# Altium project STEP_DRIVER_V3.0.PrjPcb (part 1 of 2)
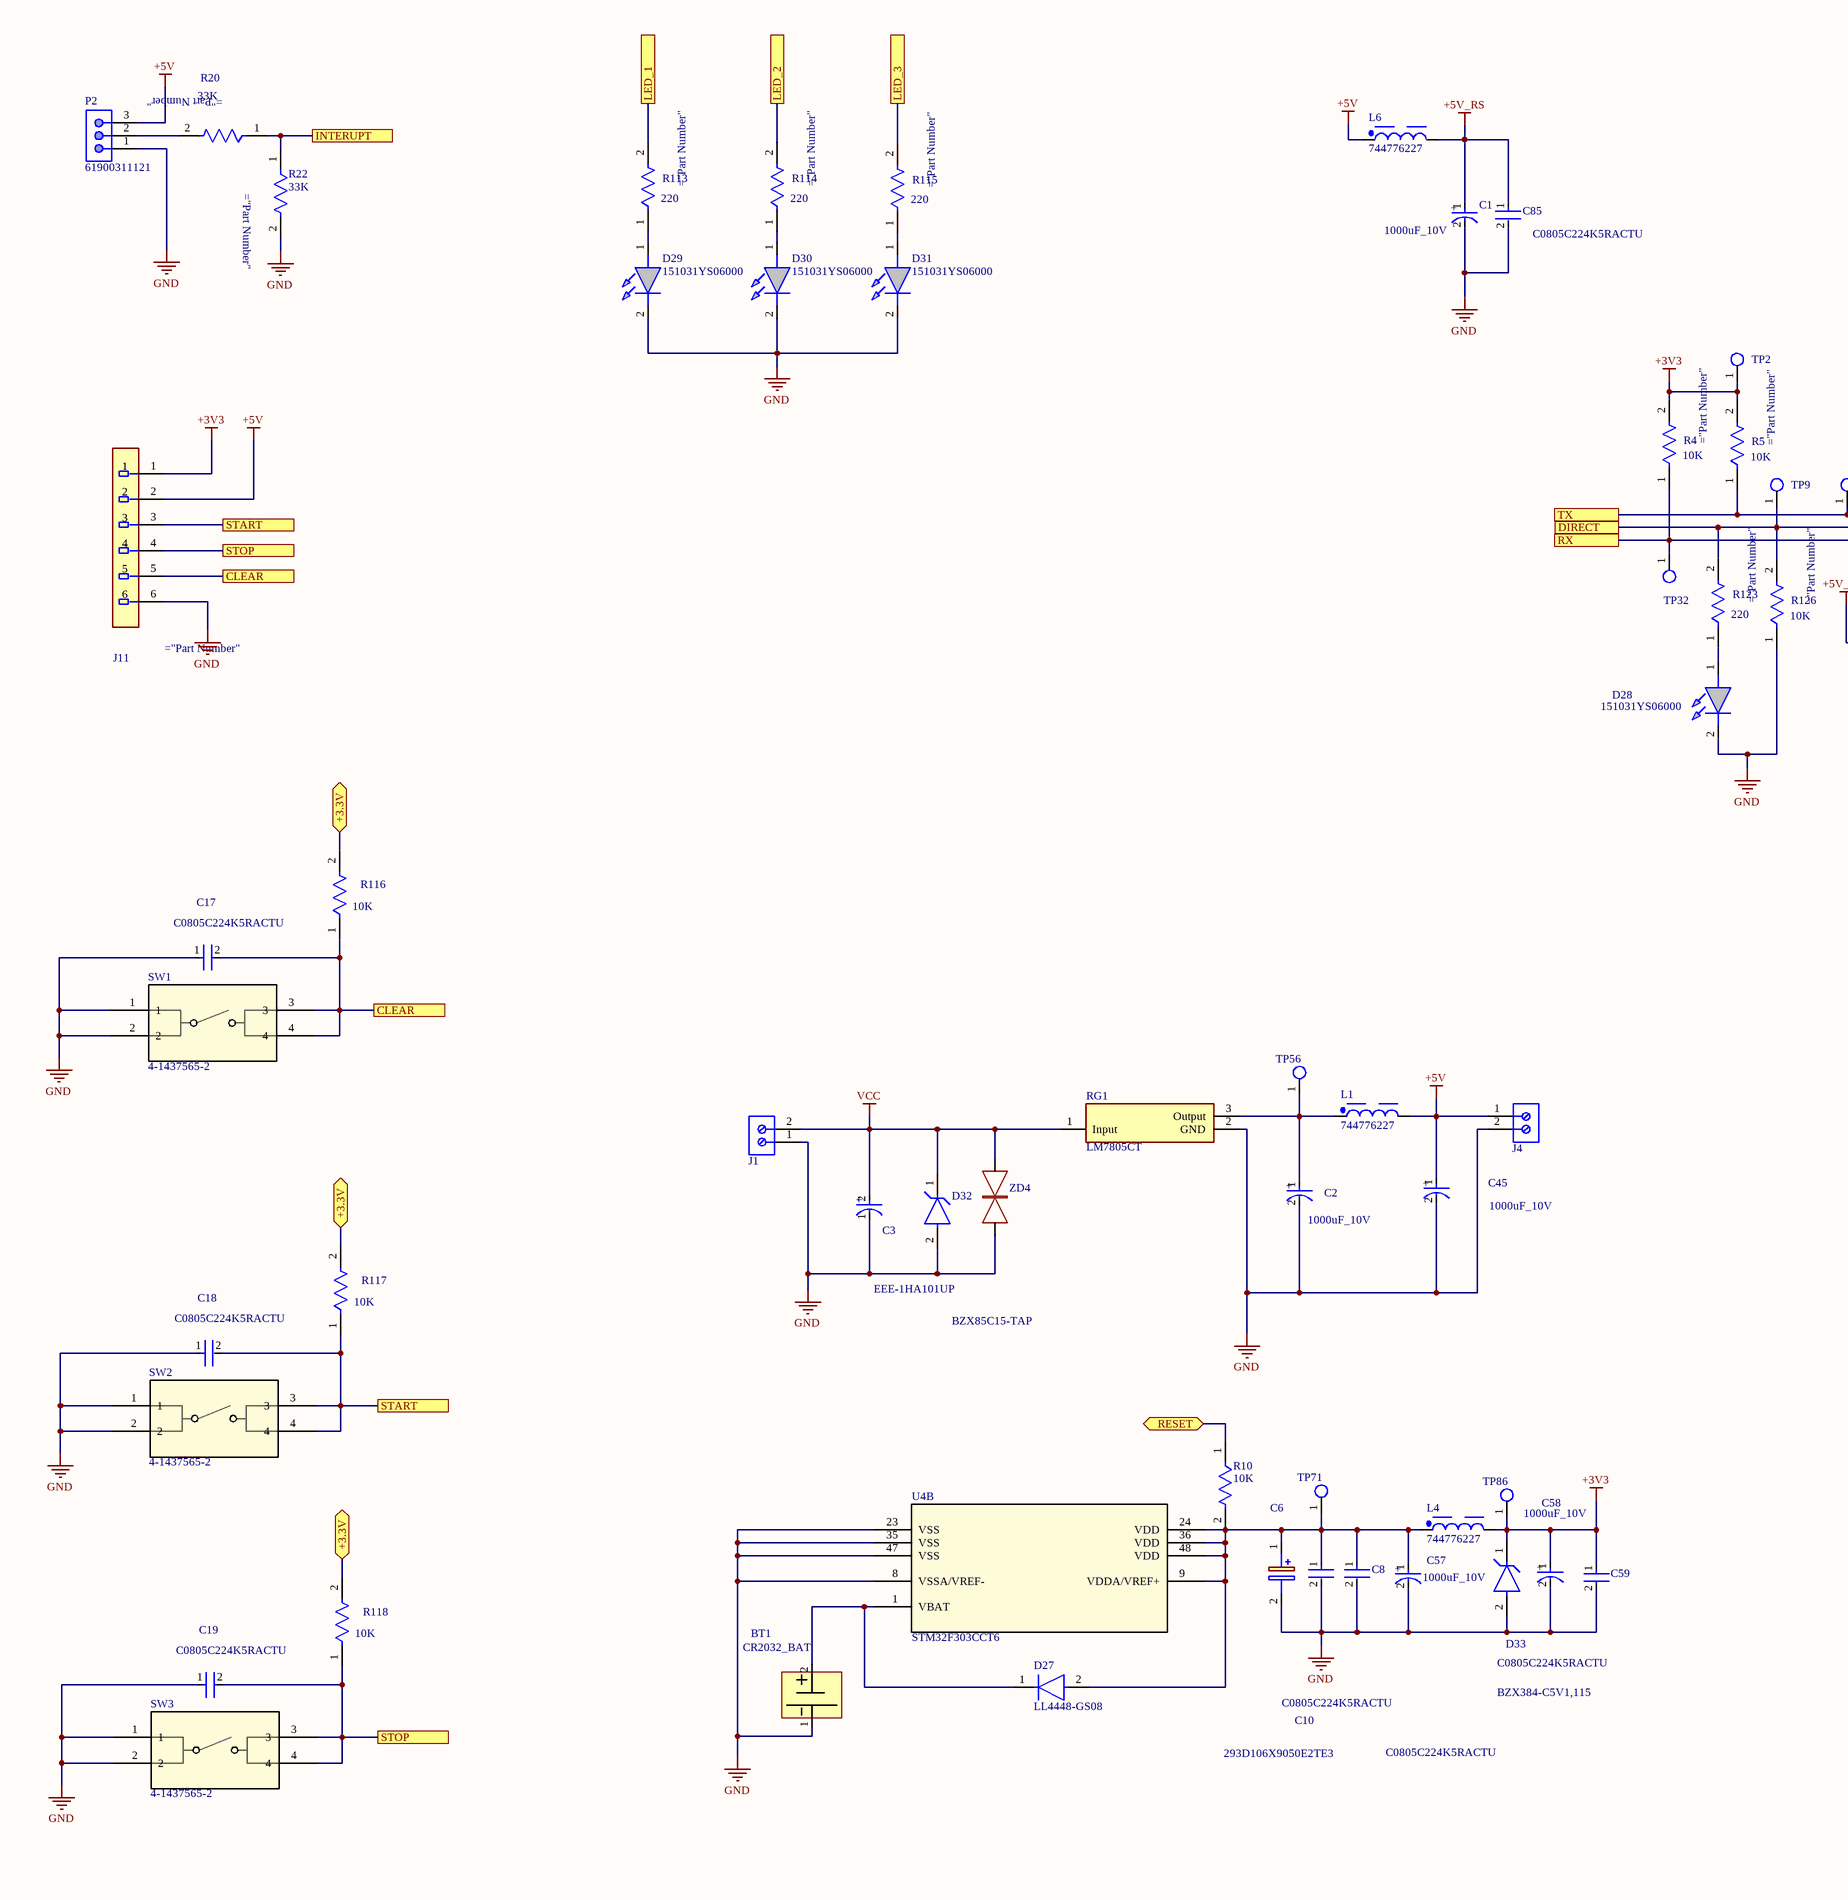
[diagram p0: STEP_DRIVER_V3.0.SchDoc, top column 1 of 4]
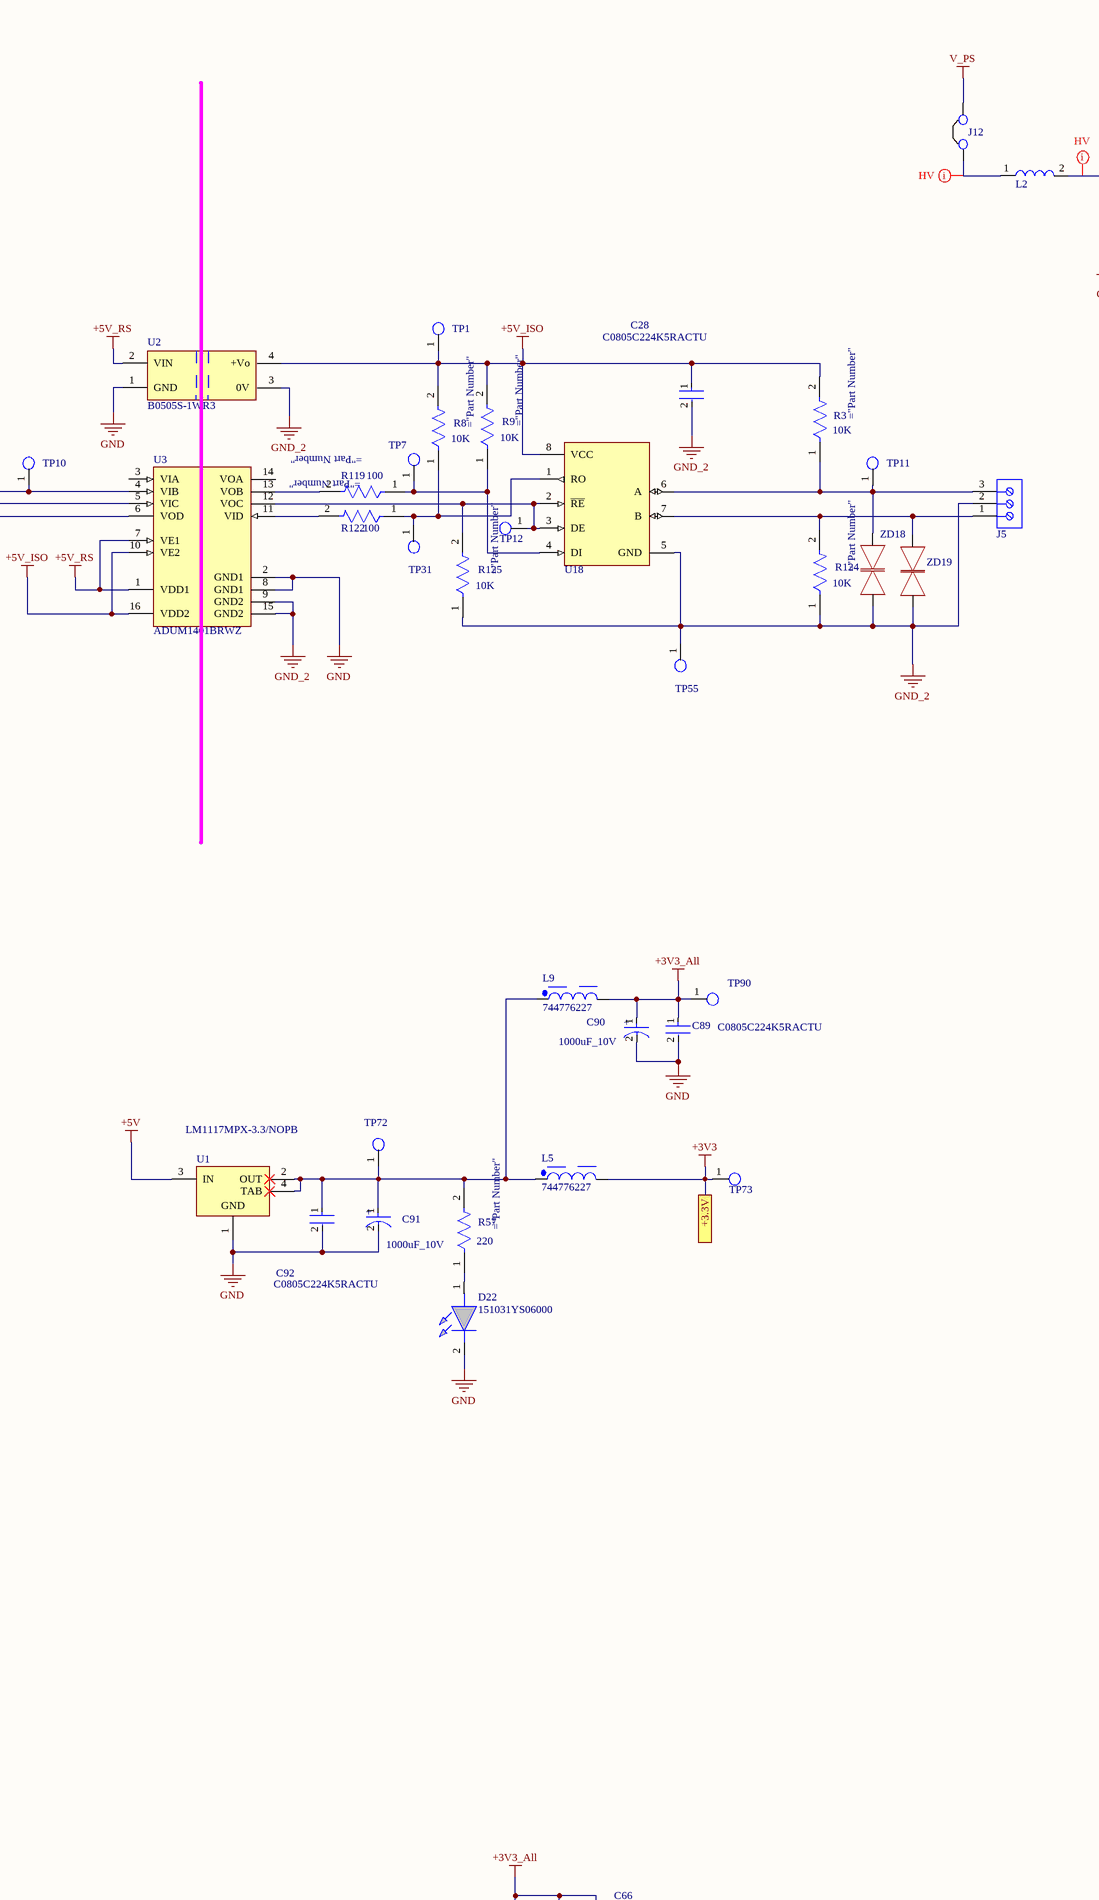
[diagram p1: STEP_DRIVER_V3.0.SchDoc, top column 2 of 4]
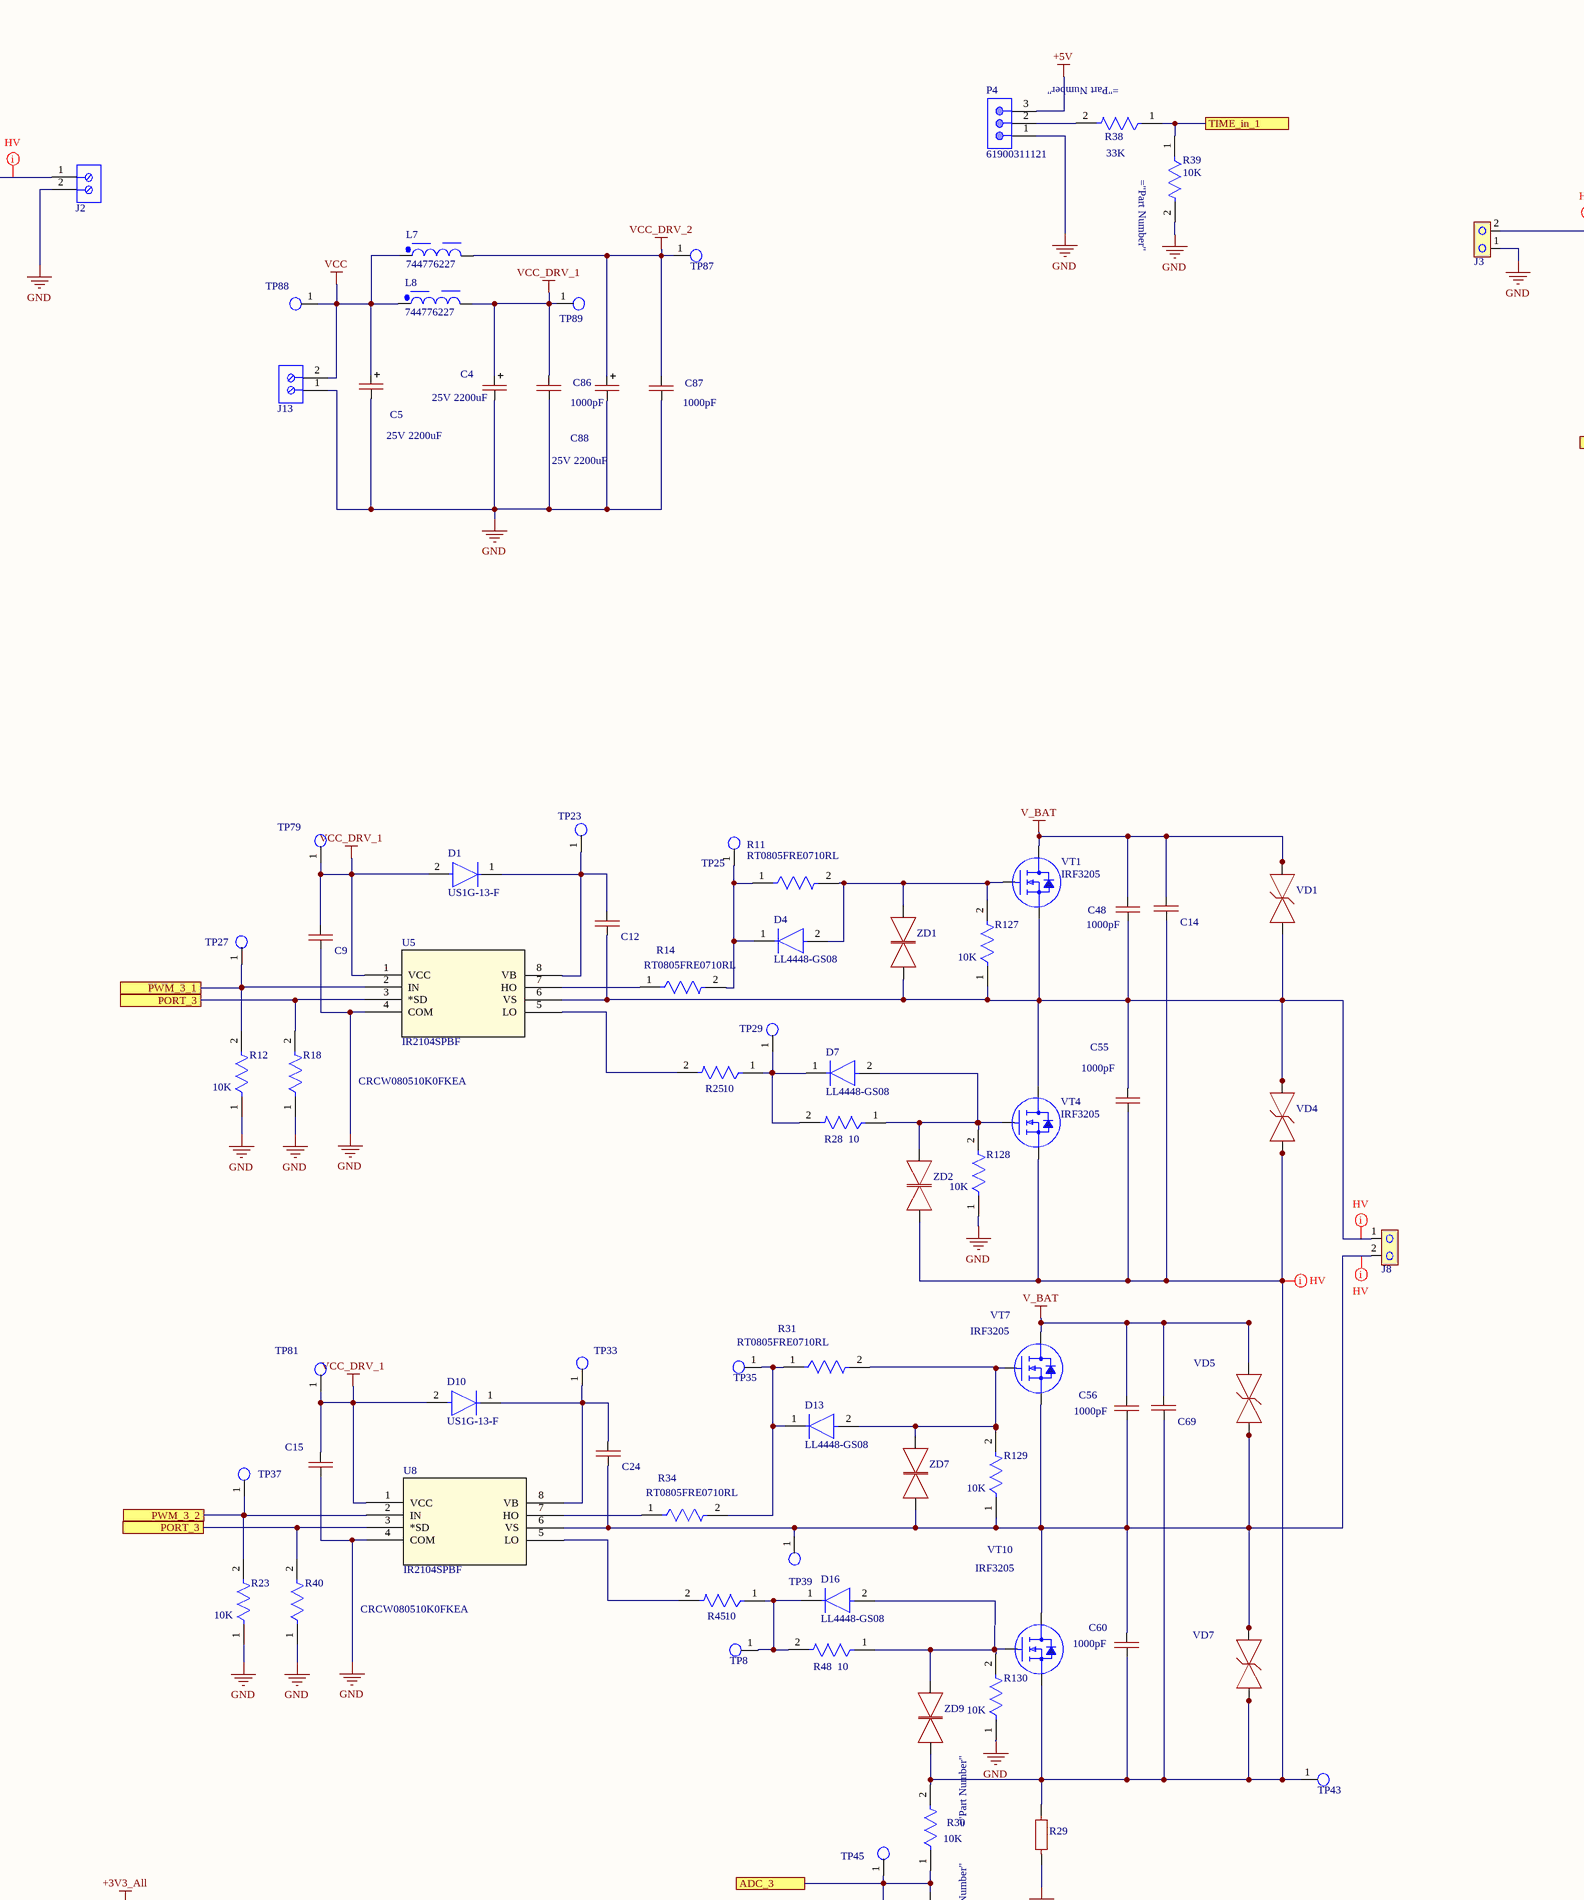
[diagram p2: STEP_DRIVER_V3.0.SchDoc, top column 3 of 4]
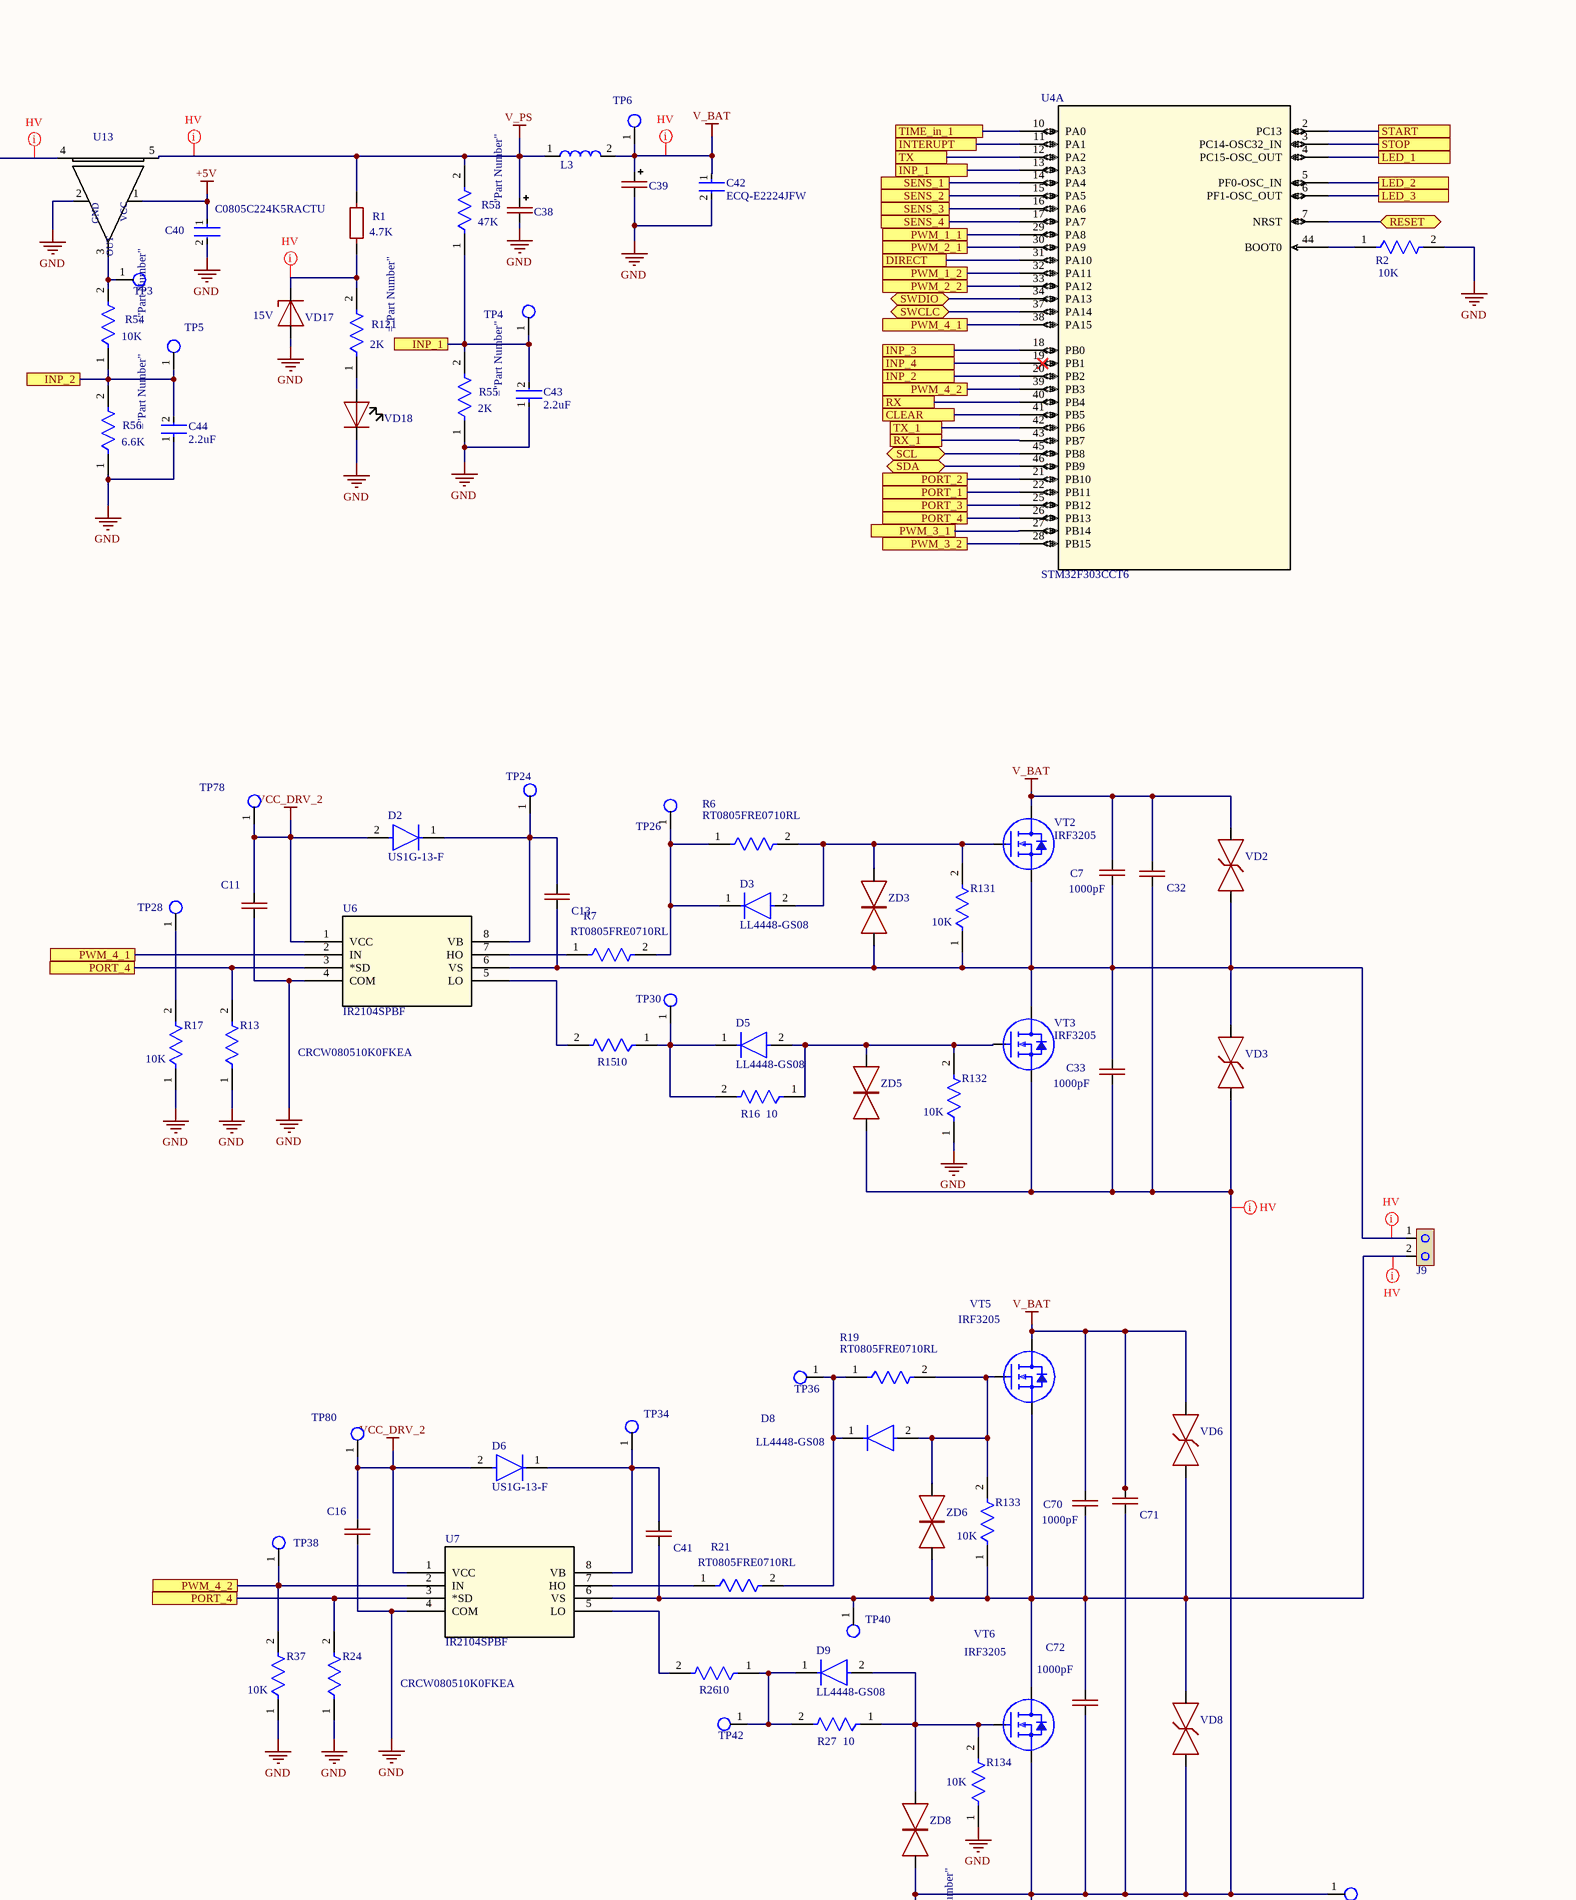
[diagram p3: STEP_DRIVER_V3.0.SchDoc, top column 4 of 4]
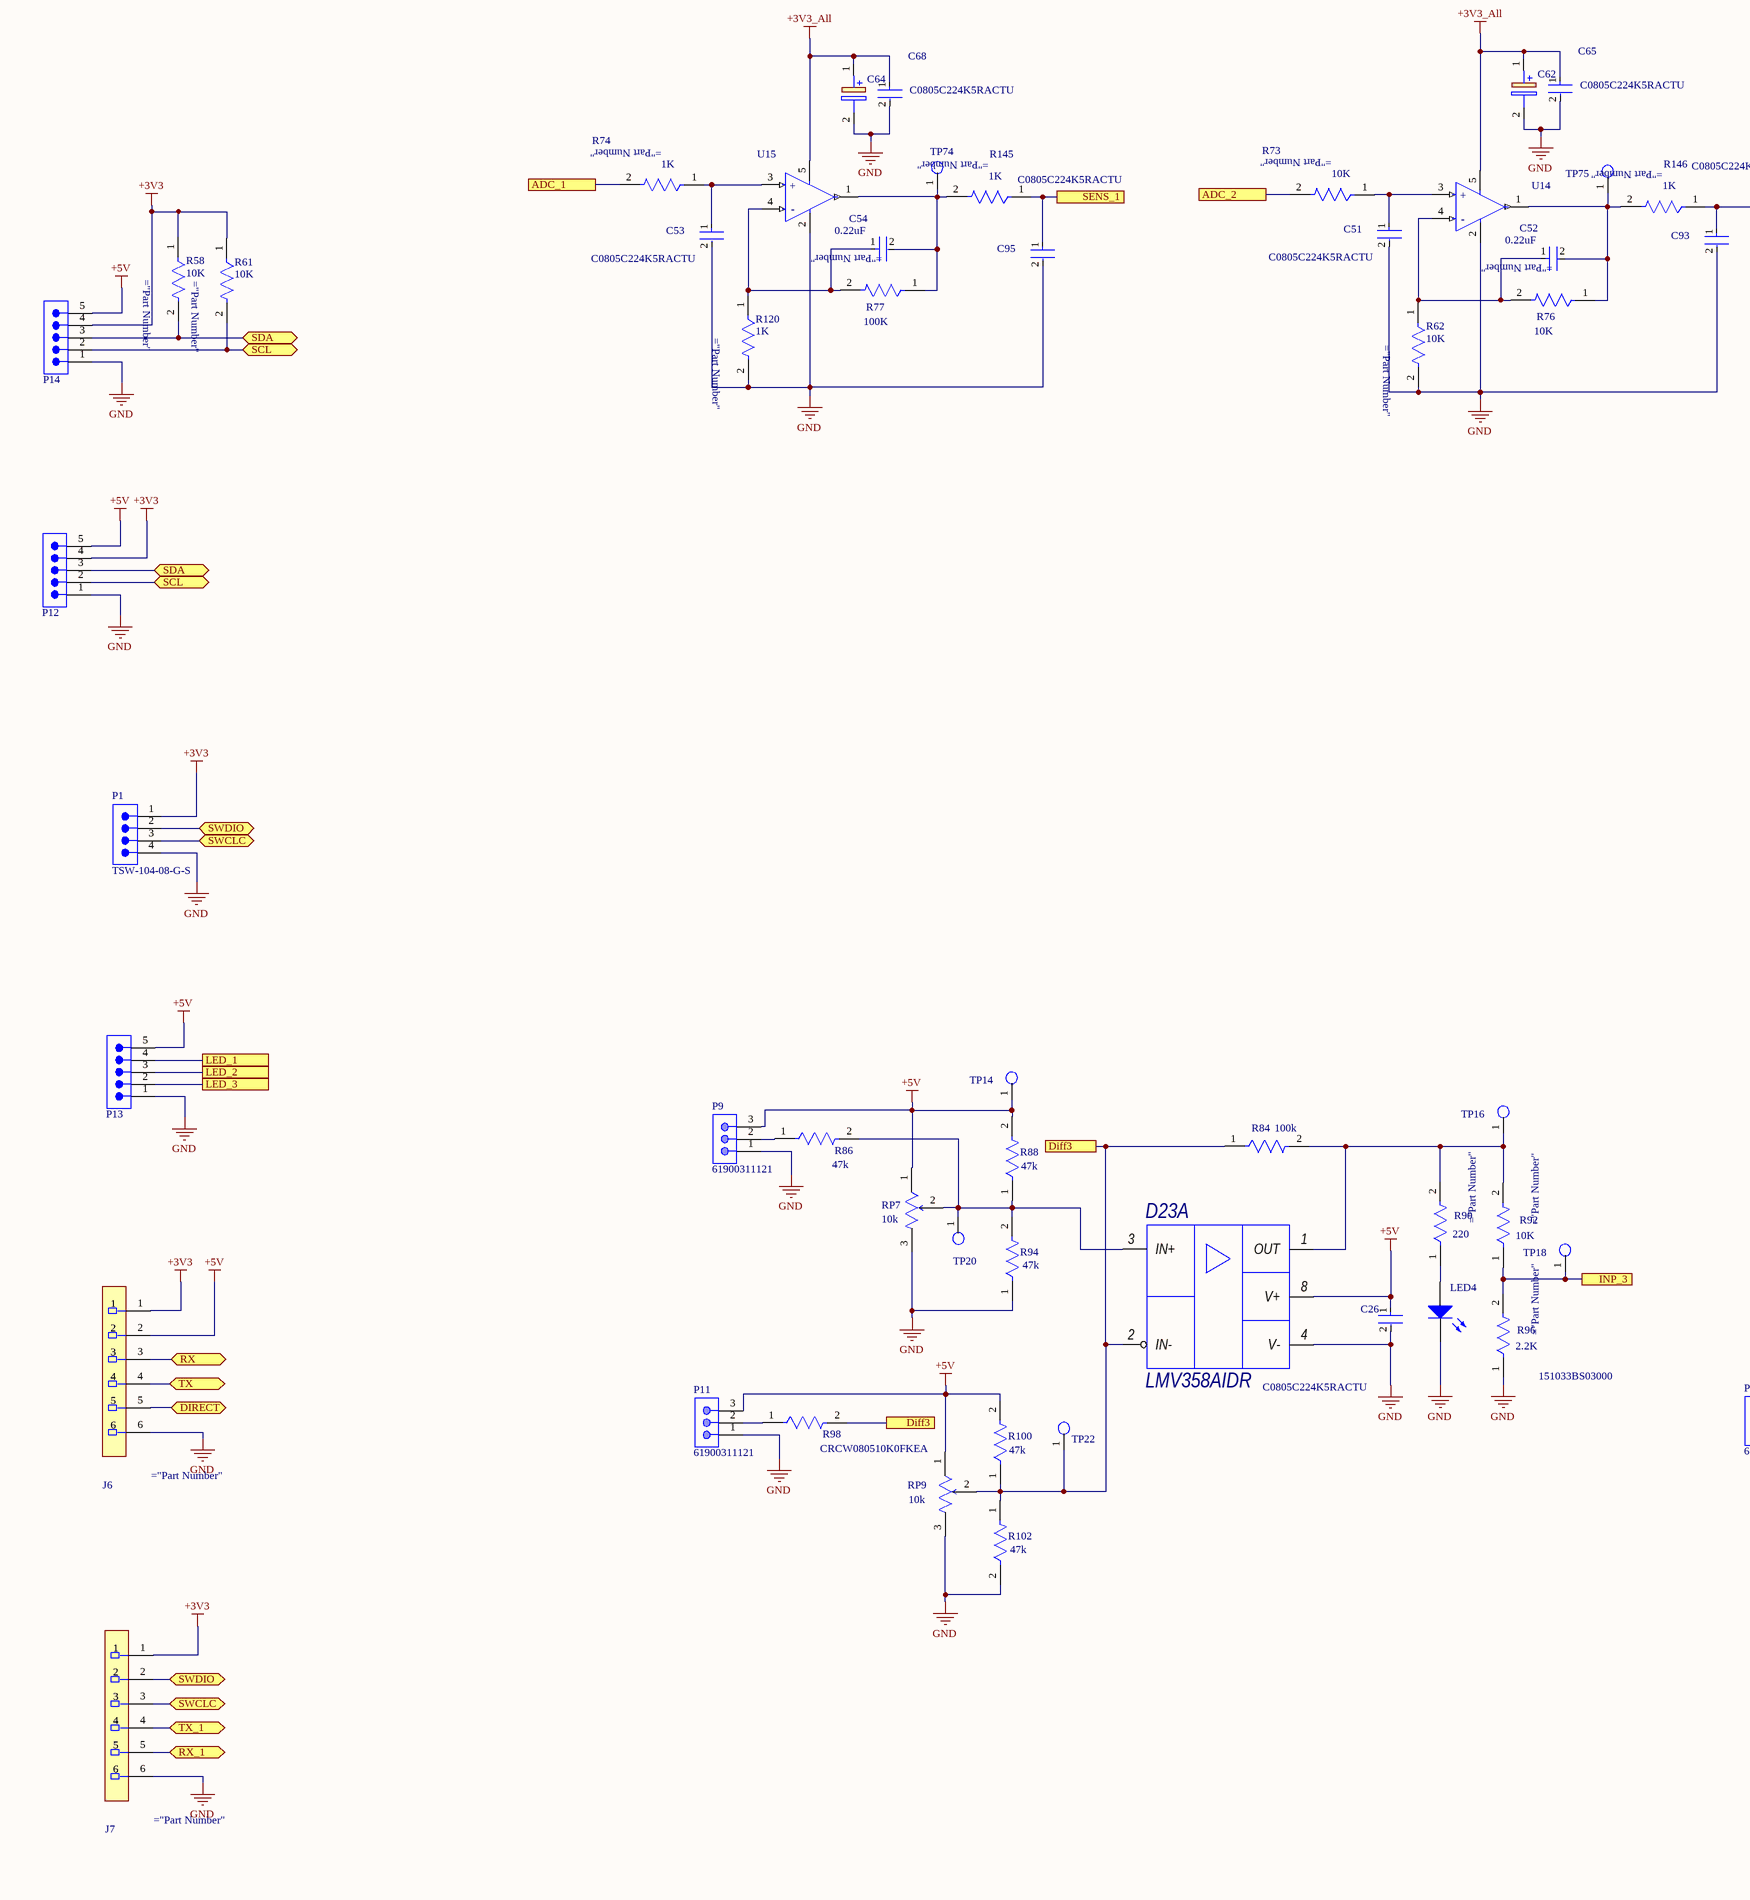
[diagram p4: STEP_DRIVER_V3.0.SchDoc, bottom column 1 of 4]
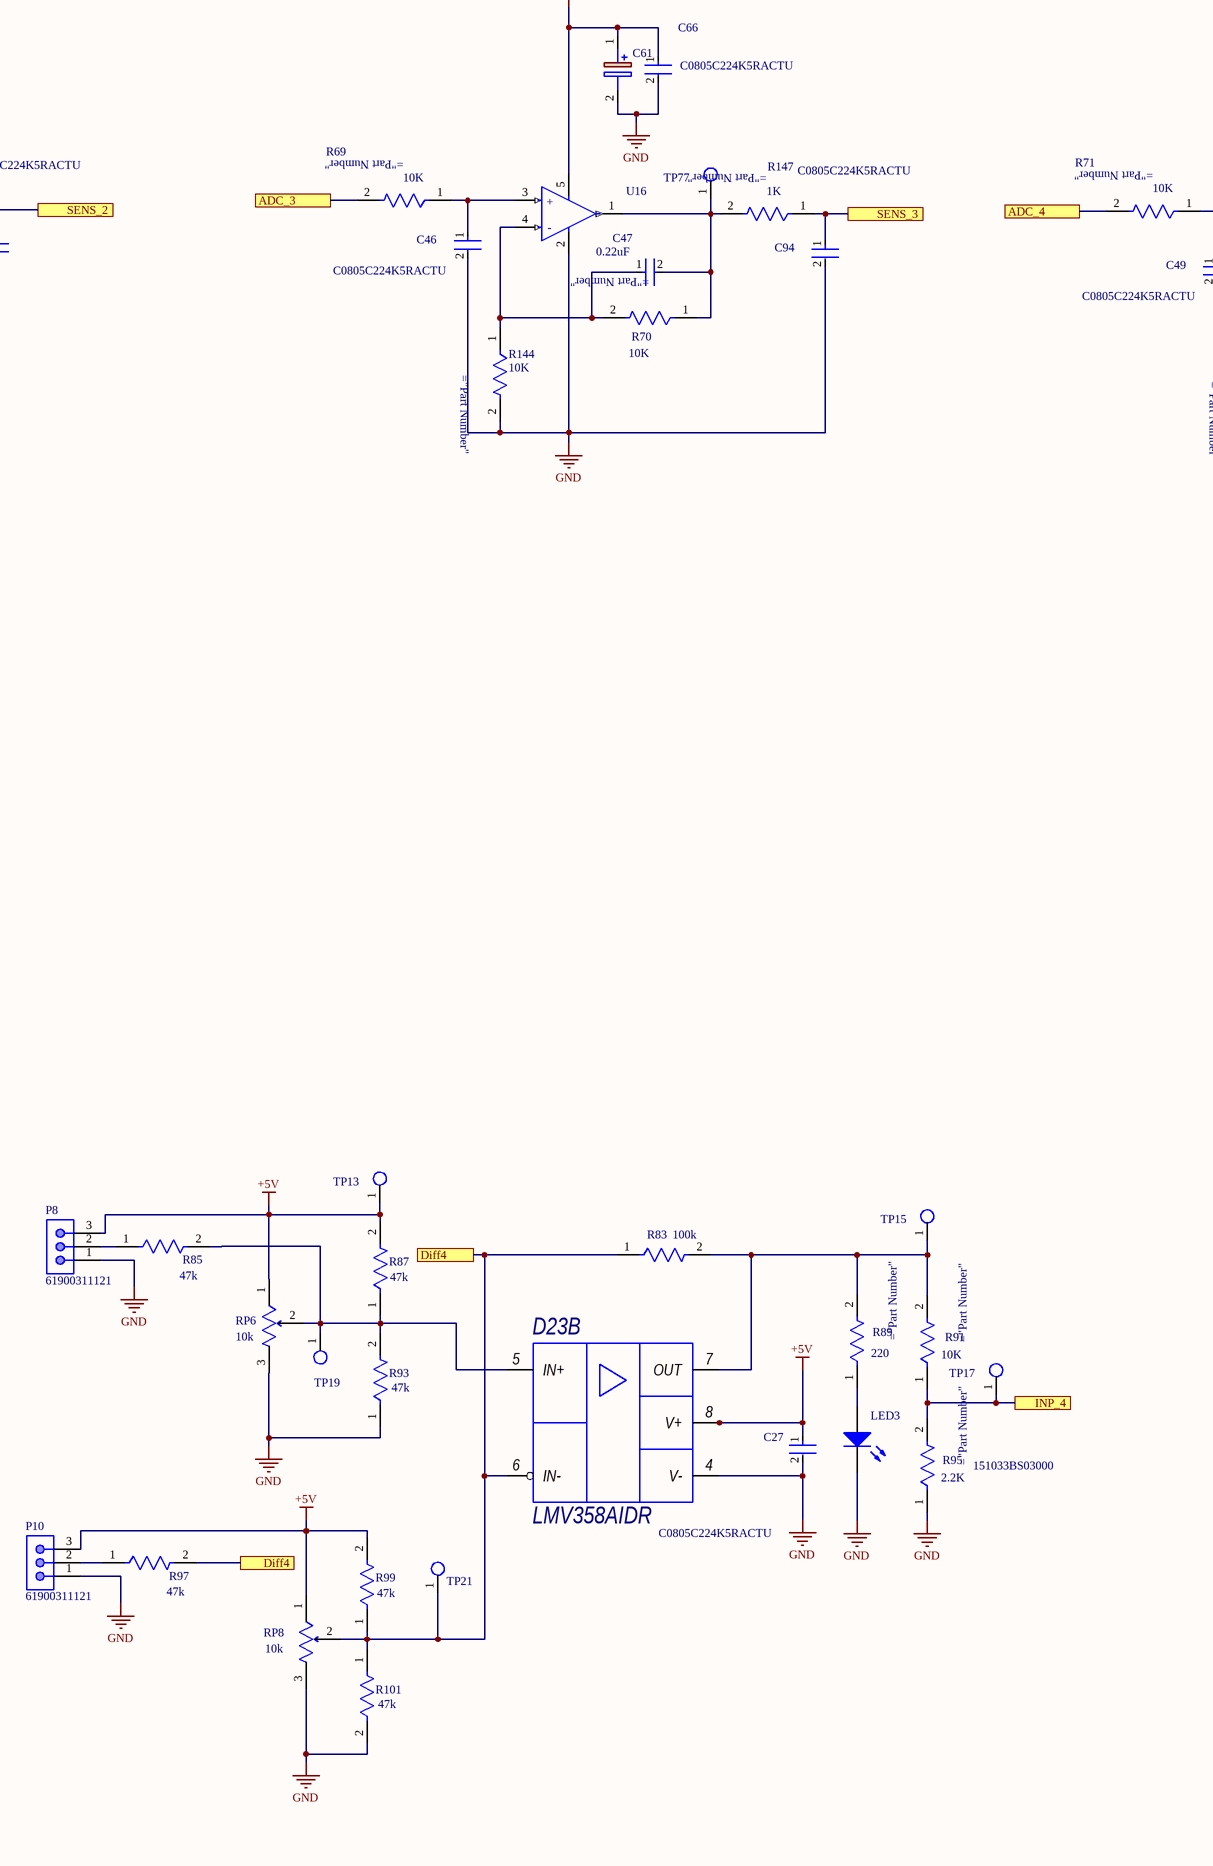
[diagram p5: STEP_DRIVER_V3.0.SchDoc, bottom column 2 of 4]
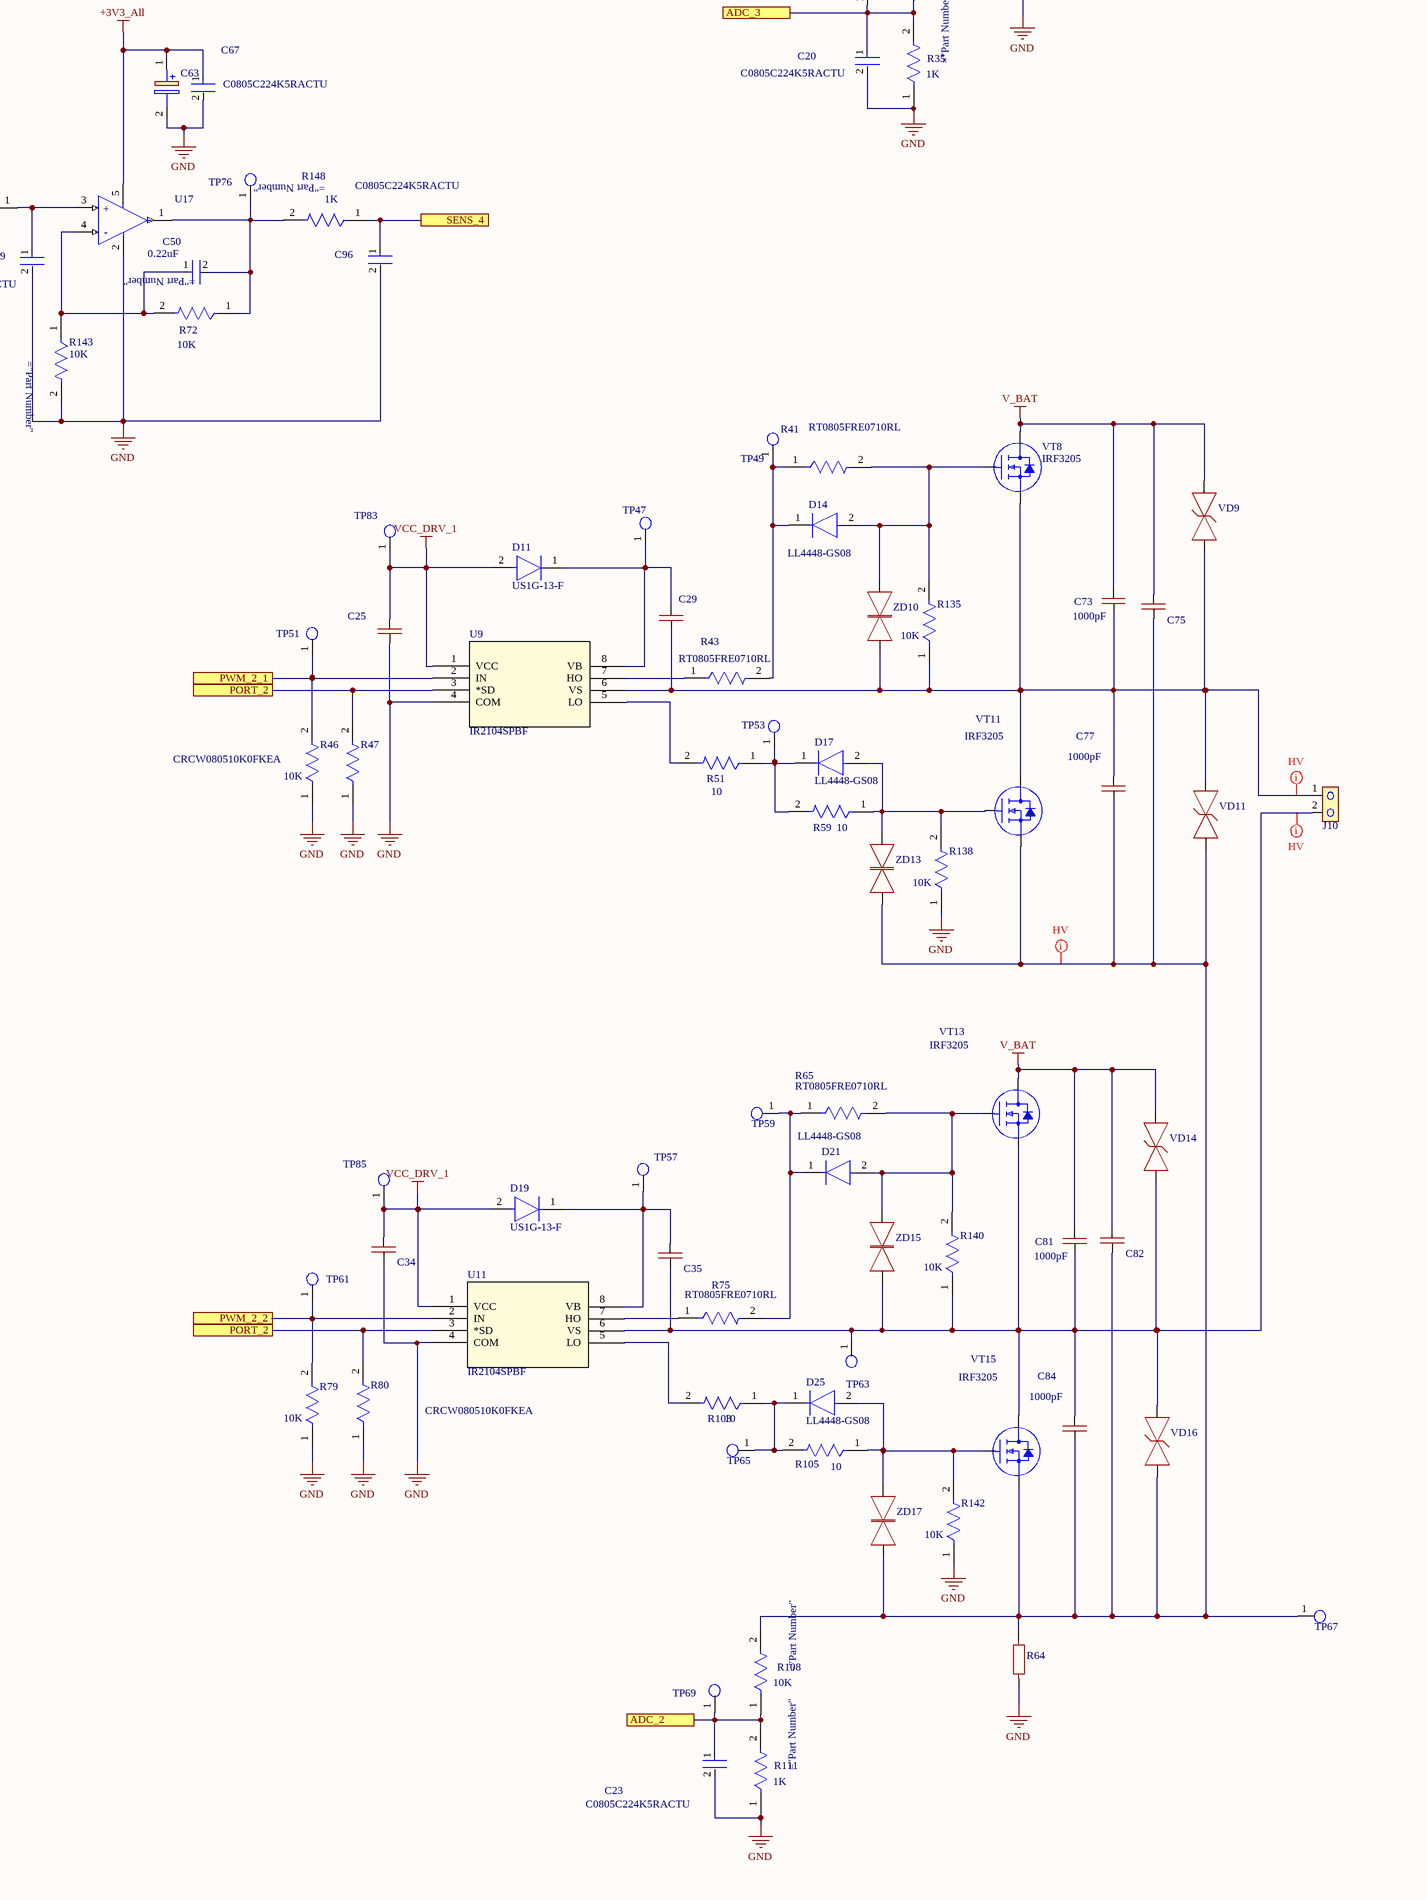
[diagram p6: STEP_DRIVER_V3.0.SchDoc, bottom column 3 of 4]
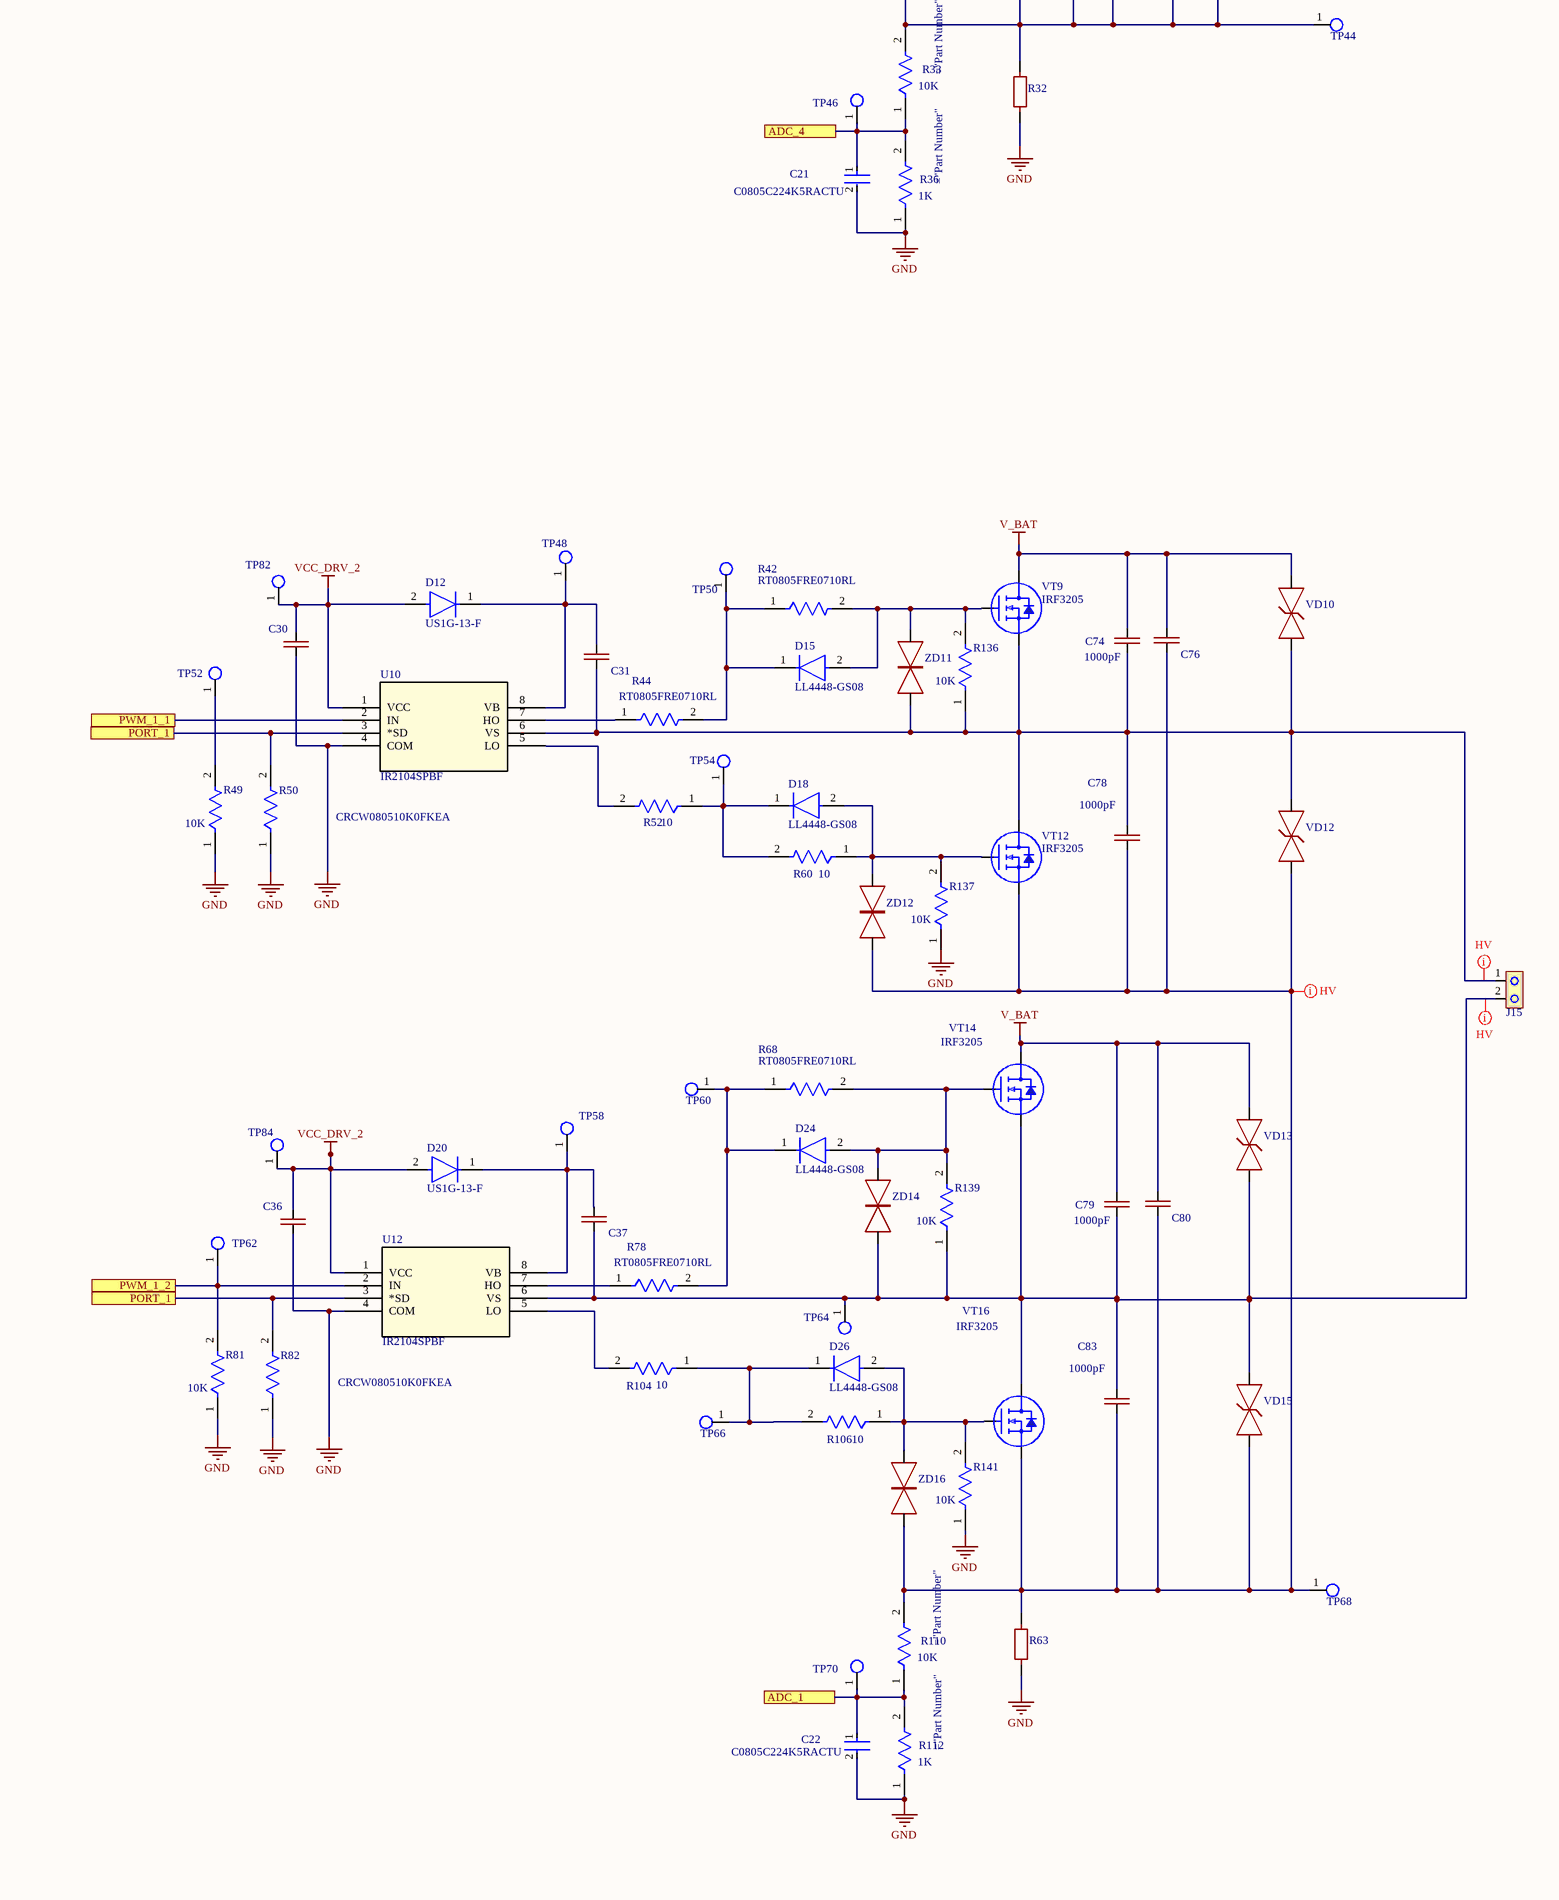
[diagram p7: STEP_DRIVER_V3.0.SchDoc, bottom column 4 of 4]
1 sheet, 477 parts. Net scope: flat (ports and power ports of the same name join across sheets).
Board file: STEP_DRIVER_V3.0.PcbDoc

## Sheet STEP_DRIVER_V3.0.SchDoc
size 1249 x 800 mm; SheetNumber: 1; SheetTotal: 1

### Parts
BT1  CR2032_BAT  [CR2032_BAT]
C1  1000uF_10V  [1000uF_10V_Size_F]
C2  1000uF_10V  [1000uF_10V_Size_F]
C3  EEE-1HA101UP  [FP-SF-MFG]
C4  25V 2200uF  [CAPPOL-12x25]
C5  25V 2200uF  [CAPPOL-12x25]
C6  293D106X9050E2TE3  [CAPPM7343X430N]
C7  1000pF  [CAP-1206]
C8  C0805C224K5RACTU  [FP-C0805C-DN-MFG]
C9  CAP-NON-POLAR  [CAP-1206]  (value not drawn)
C10  C0805C224K5RACTU  [FP-C0805C-DN-MFG]
C11  CAP-NON-POLAR  [CAP-1206]  (value not drawn)
C12  CAP-NON-POLAR  [CAP-1206]  (value not drawn)
C13  CAP-NON-POLAR  [CAP-1206]  (value not drawn)
C14  CAP-NON-POLAR  [MKP 100nF 275VAC]  (value not drawn)
C15  CAP-NON-POLAR  [CAP-1206]  (value not drawn)
C16  CAP-NON-POLAR  [CAP-1206]  (value not drawn)
C17  C0805C224K5RACTU  [FP-C0805C-DN-IPC_A]
C18  C0805C224K5RACTU  [FP-C0805C-DN-IPC_A]
C19  C0805C224K5RACTU  [FP-C0805C-DN-IPC_A]
C20  C0805C224K5RACTU  [FP-C0805C-DN-MFG]
C21  C0805C224K5RACTU  [FP-C0805C-DN-MFG]
C22  C0805C224K5RACTU  [FP-C0805C-DN-MFG]
C23  C0805C224K5RACTU  [FP-C0805C-DN-MFG]
C24  CAP-NON-POLAR  [CAP-1206]  (value not drawn)
C25  CAP-NON-POLAR  [CAP-1206]  (value not drawn)
C26  C0805C224K5RACTU  [FP-C0805C-DN-MFG]
C27  C0805C224K5RACTU  [FP-C0805C-DN-MFG]
C28  C0805C224K5RACTU  [FP-C0805C-DN-MFG]
C29  CAP-NON-POLAR  [CAP-1206]  (value not drawn)
C30  CAP-NON-POLAR  [CAP-1206]  (value not drawn)
C31  CAP-NON-POLAR  [CAP-1206]  (value not drawn)
C32  CAP-NON-POLAR  [MKP 100nF 275VAC]  (value not drawn)
C33  1000pF  [CAP-1206]
C34  CAP-NON-POLAR  [CAP-1206]  (value not drawn)
C35  CAP-NON-POLAR  [CAP-1206]  (value not drawn)
C36  CAP-NON-POLAR  [CAP-1206]  (value not drawn)
C37  CAP-NON-POLAR  [CAP-1206]  (value not drawn)
C38  CAP-POLAR  [4700uF_100V]  (value not drawn)
C39  CAP-POLAR  [4700uF_100V]  (value not drawn)
C40  C0805C224K5RACTU  [FP-C0805C-DN-MFG]
C41  CAP-NON-POLAR  [CAP-1206]  (value not drawn)
C42  ECQ-E2224JFW  [FP-ECQ-E2224JFW-MFG]
C43  2.2uF  [FP-C0805C-DN-MFG]
C44  2.2uF  [FP-C0805C-DN-MFG]
C45  1000uF_10V  [1000uF_10V_Size_F]
C46  C0805C224K5RACTU  [FP-C0805C-DN-MFG]
C47  0.22uF  [FP-C0805C-DN-MFG]
C48  1000pF  [CAP-1206]
C49  C0805C224K5RACTU  [FP-C0805C-DN-MFG]
C50  0.22uF  [FP-C0805C-DN-MFG]
C51  C0805C224K5RACTU  [FP-C0805C-DN-MFG]
C52  0.22uF  [FP-C0805C-DN-MFG]
C53  C0805C224K5RACTU  [FP-C0805C-DN-MFG]
C54  0.22uF  [FP-C0805C-DN-MFG]
C55  1000pF  [CAP-1206]
C56  1000pF  [CAP-1206]
C57  1000uF_10V  [1000uF_10V_Size_F]
C58  1000uF_10V  [1000uF_10V_Size_F]
C59  C0805C224K5RACTU  [FP-C0805C-DN-MFG]
C60  1000pF  [CAP-1206]
C61  293D106X9050E2TE3  [CAPPM7343X430N]  (value not drawn)
C62  293D106X9050E2TE3  [CAPPM7343X430N]  (value not drawn)
C63  293D106X9050E2TE3  [CAPPM7343X430N]  (value not drawn)
C64  293D106X9050E2TE3  [CAPPM7343X430N]  (value not drawn)
C65  C0805C224K5RACTU  [FP-C0805C-DN-MFG]
C66  C0805C224K5RACTU  [FP-C0805C-DN-MFG]
C67  C0805C224K5RACTU  [FP-C0805C-DN-MFG]
C68  C0805C224K5RACTU  [FP-C0805C-DN-MFG]
C69  CAP-NON-POLAR  [MKP 100nF 275VAC]  (value not drawn)
C70  1000pF  [CAP-1206]
C71  CAP-NON-POLAR  [MKP 100nF 275VAC]  (value not drawn)
C72  1000pF  [CAP-1206]
C73  1000pF  [CAP-1206]
C74  1000pF  [CAP-1206]
C75  CAP-NON-POLAR  [MKP 100nF 275VAC]  (value not drawn)
C76  CAP-NON-POLAR  [MKP 100nF 275VAC]  (value not drawn)
C77  1000pF  [CAP-1206]
C78  1000pF  [CAP-1206]
C79  1000pF  [CAP-1206]
C80  CAP-NON-POLAR  [MKP 100nF 275VAC]  (value not drawn)
C81  1000pF  [CAP-1206]
C82  CAP-NON-POLAR  [MKP 100nF 275VAC]  (value not drawn)
C83  1000pF  [CAP-1206]
C84  1000pF  [CAP-1206]
C85  C0805C224K5RACTU  [FP-C0805C-DN-MFG]
C86  1000pF  [CAP-1206]
C87  1000pF  [CAP-1206]
C88  25V 2200uF  [CAPPOL-12x25]
C89  C0805C224K5RACTU  [FP-C0805C-DN-MFG]
C90  1000uF_10V  [1000uF_10V_Size_F]
C91  1000uF_10V  [1000uF_10V_Size_F]
C92  C0805C224K5RACTU  [FP-C0805C-DN-MFG]
C93  C0805C224K5RACTU  [FP-C0805C-DN-MFG]
C94  C0805C224K5RACTU  [FP-C0805C-DN-MFG]
C95  C0805C224K5RACTU  [FP-C0805C-DN-MFG]
C96  C0805C224K5RACTU  [FP-C0805C-DN-MFG]
D1  US1G-13-F  [FP-SMA-MFG]
D2  US1G-13-F  [FP-SMA-MFG]
D3  LL4448-GS08  [FP-6_560-5005_01-4-MFG]
D4  LL4448-GS08  [FP-6_560-5005_01-4-MFG]
D5  LL4448-GS08  [FP-6_560-5005_01-4-MFG]
D6  US1G-13-F  [FP-SMA-MFG]
D7  LL4448-GS08  [FP-6_560-5005_01-4-MFG]
D8  LL4448-GS08  [FP-6_560-5005_01-4-MFG]
D9  LL4448-GS08  [FP-6_560-5005_01-4-MFG]
D10  US1G-13-F  [FP-SMA-MFG]
D11  US1G-13-F  [FP-SMA-MFG]
D12  US1G-13-F  [FP-SMA-MFG]
D13  LL4448-GS08  [FP-6_560-5005_01-4-MFG]
D14  LL4448-GS08  [FP-6_560-5005_01-4-MFG]
D15  LL4448-GS08  [FP-6_560-5005_01-4-MFG]
D16  LL4448-GS08  [FP-6_560-5005_01-4-MFG]
D17  LL4448-GS08  [FP-6_560-5005_01-4-MFG]
D18  LL4448-GS08  [FP-6_560-5005_01-4-MFG]
D19  US1G-13-F  [FP-SMA-MFG]
D20  US1G-13-F  [FP-SMA-MFG]
D21  LL4448-GS08  [FP-6_560-5005_01-4-MFG]
D22  151031YS06000  [LED_Yellow]
D23  LMV358AIDR  [8-SOIC]  (parts A,B of 2)
D24  LL4448-GS08  [FP-6_560-5005_01-4-MFG]
D25  LL4448-GS08  [FP-6_560-5005_01-4-MFG]
D26  LL4448-GS08  [FP-6_560-5005_01-4-MFG]
D27  LL4448-GS08  [FP-6_560-5005_01-4-MFG]
D28  151031YS06000  [LED_BLUE]
D29  151031YS06000  [Wurth_Electronics_0_MFG]
D30  151031YS06000  [LED_GREEN]
D31  151031YS06000  [LED_BLUE]
D32  BZX85C15-TAP  [FP-6_561-5001_02-4-MFG]
D33  BZX384-C5V1,115  [FP-SOD323-MFG]
J1  691101710002  [691101710002]  (value not drawn)
J2  691101710002  [691101710002]  (value not drawn)
J3  TL-800  [Conn_Tianli_T-800]  (value not drawn)
J4  691101710002  [691101710002]  (value not drawn)
J5  691101710003  [691101710003]  (value not drawn)
J6  SWR25X-NRTC-S06-ST-BA  [Sullins_SWR25X-NRTC-S06-ST-BA_MFG]  (value not drawn)
J7  SWR25X-NRTC-S06-ST-BA  [Sullins_SWR25X-NRTC-S06-ST-BA_MFG]  (value not drawn)
J8  TL-800  [Conn_Tianli_T-800]  (value not drawn)
J9  TL-800  [Conn_Tianli_T-800]  (value not drawn)
J10  TL-800  [Conn_Tianli_T-800]  (value not drawn)
J11  SWR25X-NRTC-S06-ST-BA  [Sullins_SWR25X-NRTC-S06-ST-BA_MFG]  (value not drawn)
J12  Jumper 1x2.54  [Jumper_2.54]  (value not drawn)
J13  691101710002  [691101710002]  (value not drawn)
J15  TL-800  [Conn_Tianli_T-800]  (value not drawn)
L1  744776227  [WE-PD2_1054]
L2  Coil  [Coil_drosel]  (value not drawn)
L3  Coil  [Coil_drosel]  (value not drawn)
L4  744776227  [WE-PD2_1054]
L5  744776227  [WE-PD2_1054]
L6  744776227  [WE-PD2_1054]
L7  744776227  [WE-PD2_1054]
L8  744776227  [WE-PD2_1054]
L9  744776227  [WE-PD2_1054]
LED3  151033BS03000  [Type 3mm]
LED4  151033BS03000  [Type 3mm]
P1  TSW-104-08-G-S  [SMTC-TSW-104-08-X-S]
P2  61900311121  [61900311121]
P4  61900311121  [61900311121]
P8  61900311121  [61900311121]
P9  61900311121  [61900311121]
P10  61900311121  [61900311121]
P11  61900311121  [61900311121]
P12  61300511121  [61300511121]  (value not drawn)
P13  61300511121  [61300511121]  (value not drawn)
P14  61300511121  [61300511121]  (value not drawn)
R1  4.7K  [RES-2512]
R2  10K  [Vishay_CRCW0805-e3_IPC_A]
R3  10K  [Vishay_CRCW0805-e3_IPC_A]
R4  10K  [Vishay_CRCW0805-e3_IPC_A]
R5  10K  [Vishay_CRCW0805-e3_IPC_A]
R6  RT0805FRE0710RL  [FP-RT0805-IPC_C]
R7  RT0805FRE0710RL  [FP-RT0805-MFG]
R8  10K  [Yageo_RC0805_IPC_A]
R9  10K  [Yageo_RC0805_IPC_A]
R10  10K  [Vishay_CRCW0805-e3_IPC_A]
R11  RT0805FRE0710RL  [FP-RT0805-IPC_C]
R12  10K  [FP-CRCW0805-e3-IPC_A]
R13  CRCW080510K0FKEA  [FP-CRCW0805-e3-IPC_A]
R14  RT0805FRE0710RL  [FP-RT0805-MFG]
R15  10  [Vishay_CRCW0805-e3_IPC_A]
R16  10  [Vishay_CRCW0805-e3_IPC_A]
R17  10K  [FP-CRCW0805-e3-IPC_A]
R18  CRCW080510K0FKEA  [FP-CRCW0805-e3-IPC_A]
R19  RT0805FRE0710RL  [FP-RT0805-IPC_C]
R20  33K  [Vishay_CRCW0805-e3_IPC_A]
R21  RT0805FRE0710RL  [FP-RT0805-MFG]
R22  33K  [Vishay_CRCW0805-e3_IPC_A]
R23  10K  [FP-CRCW0805-e3-IPC_A]
R24  CRCW080510K0FKEA  [FP-CRCW0805-e3-IPC_A]
R25  10  [Vishay_CRCW0805-e3_IPC_A]
R26  10  [Vishay_CRCW0805-e3_IPC_A]
R27  10  [Vishay_CRCW0805-e3_IPC_A]
R28  10  [FP-CRCW0805-e3-IPC_B]
R29  RES-CONST  [RES-3921]  (value not drawn)
R30  10K  [Yageo_RC0805_IPC_C]
R31  RT0805FRE0710RL  [FP-RT0805-IPC_C]
R32  RES-CONST  [RES-3921]  (value not drawn)
R33  10K  [Yageo_RC0805_IPC_C]
R34  RT0805FRE0710RL  [FP-RT0805-MFG]
R35  1K  [Yageo_RC0805_IPC_A]
R36  1K  [Yageo_RC0805_IPC_A]
R37  10K  [FP-CRCW0805-e3-IPC_A]
R38  33K  [Vishay_CRCW0805-e3_IPC_A]
R39  10K  [Vishay_CRCW0805-e3_IPC_A]
R40  CRCW080510K0FKEA  [FP-CRCW0805-e3-IPC_A]
R41  RT0805FRE0710RL  [FP-RT0805-IPC_C]
R42  RT0805FRE0710RL  [FP-RT0805-IPC_C]
R43  RT0805FRE0710RL  [FP-RT0805-MFG]
R44  RT0805FRE0710RL  [FP-RT0805-MFG]
R45  10  [Vishay_CRCW0805-e3_IPC_A]
R46  10K  [FP-CRCW0805-e3-IPC_A]
R47  CRCW080510K0FKEA  [FP-CRCW0805-e3-IPC_A]
R48  10  [Vishay_CRCW0805-e3_IPC_A]
R49  10K  [FP-CRCW0805-e3-IPC_A]
R50  CRCW080510K0FKEA  [FP-CRCW0805-e3-IPC_A]
R51  10  [Vishay_CRCW0805-e3_IPC_A]
R52  10  [Vishay_CRCW0805-e3_IPC_A]
R53  47K  [Vishay_CRCW0805-e3_IPC_A]
R54  10K  [Vishay_CRCW0805-e3_IPC_A]
R55  2K  [Vishay_CRCW0805-e3_IPC_A]
R56  6.6K  [Vishay_CRCW0805-e3_IPC_A]
R57  220  [Yageo_RC0805_IPC_A]
R58  10K  [Yageo_RC0805_IPC_C]
R59  10  [FP-CRCW0805-e3-IPC_B]
R60  10  [Vishay_CRCW0805-e3_IPC_A]
R61  10K  [Yageo_RC0805_IPC_C]
R62  10K  [Yageo_RC0805_IPC_C]
R63  RES-CONST  [RES-3921]  (value not drawn)
R64  RES-CONST  [RES-3921]  (value not drawn)
R65  RT0805FRE0710RL  [FP-RT0805-IPC_C]
R68  RT0805FRE0710RL  [FP-RT0805-IPC_C]
R69  10K  [Yageo_RC0805_IPC_C]
R70  10K  [Yageo_RC0805_IPC_C]
R71  10K  [Yageo_RC0805_IPC_C]
R72  10K  [Yageo_RC0805_IPC_C]
R73  10K  [Yageo_RC0805_IPC_C]
R74  1K  [Yageo_RC0805_IPC_C]
R75  RT0805FRE0710RL  [FP-RT0805-MFG]
R76  10K  [Yageo_RC0805_IPC_C]
R77  100K  [Yageo_RC0805_IPC_C]
R78  RT0805FRE0710RL  [FP-RT0805-MFG]
R79  10K  [FP-CRCW0805-e3-IPC_A]
R80  CRCW080510K0FKEA  [FP-CRCW0805-e3-IPC_A]
R81  10K  [FP-CRCW0805-e3-IPC_A]
R82  CRCW080510K0FKEA  [FP-CRCW0805-e3-IPC_A]
R83  100k  [Vishay_CRCW0805-e3_IPC_A]
R84  100k  [Vishay_CRCW0805-e3_IPC_A]
R85  47k  [Vishay_CRCW0805-e3_IPC_A]
R86  47k  [Vishay_CRCW0805-e3_IPC_A]
R87  47k  [Vishay_CRCW0805-e3_IPC_A]
R88  47k  [FP-CRCW0805-e3-IPC_A]
R89  220  [Vishay_CRCW0805-e3_IPC_A]
R90  220  [Vishay_CRCW0805-e3_IPC_A]
R91  10K  [Vishay_CRCW0805-e3_IPC_A]
R92  10K  [Vishay_CRCW0805-e3_IPC_A]
R93  47k  [Vishay_CRCW0805-e3_IPC_A]
R94  47k  [Vishay_CRCW0805-e3_IPC_A]
R95  2.2K  [Vishay_CRCW0805-e3_IPC_A]
R96  2.2K  [Vishay_CRCW0805-e3_IPC_A]
R97  47k  [Vishay_CRCW0805-e3_IPC_A]
R98  CRCW080510K0FKEA  [FP-CRCW0805-e3-IPC_A]
R99  47k  [Vishay_CRCW0805-e3_IPC_A]
R100  47k  [Vishay_CRCW0805-e3_IPC_A]
R101  47k  [Vishay_CRCW0805-e3_IPC_A]
R102  47k  [Vishay_CRCW0805-e3_IPC_A]
R103  10  [Vishay_CRCW0805-e3_IPC_A]
R104  10  [Vishay_CRCW0805-e3_IPC_A]
R105  10  [Vishay_CRCW0805-e3_IPC_A]
R106  10  [Vishay_CRCW0805-e3_IPC_A]
R108  10K  [Yageo_RC0805_IPC_C]
R110  10K  [Yageo_RC0805_IPC_C]
R111  1K  [Yageo_RC0805_IPC_A]
R112  1K  [Yageo_RC0805_IPC_A]
R113  220  [Yageo_RC0805_IPC_C]
R114  220  [Yageo_RC0805_IPC_A]
R115  220  [Yageo_RC0805_IPC_A]
R116  10K  [FP-CRCW0805-e3-IPC_A]
R117  10K  [FP-CRCW0805-e3-IPC_A]
R118  10K  [FP-CRCW0805-e3-IPC_A]
R119  100  [Yageo_RC0805_IPC_A]
R120  1K  [Yageo_RC0805_IPC_C]
R121  2K  [Yageo_RC0805_IPC_A]
R122  100  [Yageo_RC0805_IPC_A]
R123  220  [Yageo_RC0805_IPC_A]
R124  10K  [Yageo_RC0805_IPC_A]
R125  10K  [Yageo_RC0805_IPC_A]
R126  10K  [Vishay_CRCW0805-e3_IPC_A]
R127  10K  [FP-CRCW0805-e3-IPC_A]
R128  10K  [FP-CRCW0805-e3-IPC_A]
R129  10K  [FP-CRCW0805-e3-IPC_A]
R130  10K  [FP-CRCW0805-e3-IPC_A]
R131  10K  [FP-CRCW0805-e3-IPC_A]
R132  10K  [FP-CRCW0805-e3-IPC_A]
R133  10K  [FP-CRCW0805-e3-IPC_A]
R134  10K  [FP-CRCW0805-e3-IPC_A]
R135  10K  [FP-CRCW0805-e3-IPC_A]
R136  10K  [FP-CRCW0805-e3-IPC_A]
R137  10K  [FP-CRCW0805-e3-IPC_A]
R138  10K  [FP-CRCW0805-e3-IPC_A]
R139  10K  [FP-CRCW0805-e3-IPC_A]
R140  10K  [FP-CRCW0805-e3-IPC_A]
R141  10K  [FP-CRCW0805-e3-IPC_A]
R142  10K  [FP-CRCW0805-e3-IPC_A]
R143  10K  [Yageo_RC0805_IPC_C]
R144  10K  [Yageo_RC0805_IPC_C]
R145  1K  [Yageo_RC0805_IPC_C]
R146  1K  [Yageo_RC0805_IPC_C]
R147  1K  [Yageo_RC0805_IPC_C]
R148  1K  [Yageo_RC0805_IPC_C]
RG1  Part Number: LM7805CT  [TO-220(bend_rad)]  (hidden comment: Reg_Fairchild_LM7805CT_eec)
RP6  10k  [Bourns_3296W_MFG]
RP7  10k  [Bourns_3296W_MFG]
RP8  10k  [Bourns_3296W_MFG]
RP9  10k  [Bourns_3296W_MFG]
SW1  4-1437565-2  [SW4_FSM-5P23_TEC]
SW2  4-1437565-2  [SW4_FSM-5P23_TEC]
SW3  4-1437565-2  [SW4_FSM-5P23_TEC]
TP1  Test_Point_PCB  [Test_Point]  (value not drawn)
TP2  Test_Point_PCB  [Test_Point]  (value not drawn)
TP3  Test_Point_PCB  [Test_Point]  (value not drawn)
TP4  Test_Point_PCB  [Test_Point]  (value not drawn)
TP5  Test_Point_PCB  [Test_Point]  (value not drawn)
TP6  Test_Point_PCB  [Test_Point]  (value not drawn)
TP7  Test_Point_PCB  [Test_Point]  (value not drawn)
TP8  Test_Point_PCB  [Test_Point]  (value not drawn)
TP9  Test_Point_PCB  [Test_Point]  (value not drawn)
TP10  Test_Point_PCB  [Test_Point]  (value not drawn)
TP11  Test_Point_PCB  [Test_Point]  (value not drawn)
TP12  Test_Point_PCB  [Test_Point]  (value not drawn)
TP13  Test_Point_PCB  [Test_Point]  (value not drawn)
TP14  Test_Point_PCB  [Test_Point]  (value not drawn)
TP15  Test_Point_PCB  [Test_Point]  (value not drawn)
TP16  Test_Point_PCB  [Test_Point]  (value not drawn)
TP17  Test_Point_PCB  [Test_Point]  (value not drawn)
TP18  Test_Point_PCB  [Test_Point]  (value not drawn)
TP19  Test_Point_PCB  [Test_Point]  (value not drawn)
TP20  Test_Point_PCB  [Test_Point]  (value not drawn)
TP21  Test_Point_PCB  [Test_Point]  (value not drawn)
TP22  Test_Point_PCB  [Test_Point]  (value not drawn)
TP23  Test_Point_PCB  [Test_Point]  (value not drawn)
TP24  Test_Point_PCB  [Test_Point]  (value not drawn)
TP25  Test_Point_PCB  [Test_Point]  (value not drawn)
TP26  Test_Point_PCB  [Test_Point]  (value not drawn)
TP27  Test_Point_PCB  [Test_Point]  (value not drawn)
TP28  Test_Point_PCB  [Test_Point]  (value not drawn)
TP29  Test_Point_PCB  [Test_Point]  (value not drawn)
TP30  Test_Point_PCB  [Test_Point]  (value not drawn)
TP31  Test_Point_PCB  [Test_Point]  (value not drawn)
TP32  Test_Point_PCB  [Test_Point]  (value not drawn)
TP33  Test_Point_PCB  [Test_Point]  (value not drawn)
TP34  Test_Point_PCB  [Test_Point]  (value not drawn)
TP35  Test_Point_PCB  [Test_Point]  (value not drawn)
TP36  Test_Point_PCB  [Test_Point]  (value not drawn)
TP37  Test_Point_PCB  [Test_Point]  (value not drawn)
TP38  Test_Point_PCB  [Test_Point]  (value not drawn)
TP39  Test_Point_PCB  [Test_Point]  (value not drawn)
TP40  Test_Point_PCB  [Test_Point]  (value not drawn)
TP42  Test_Point_PCB  [Test_Point]  (value not drawn)
TP43  Test_Point_PCB  [Test_Point]  (value not drawn)
TP44  Test_Point_PCB  [Test_Point]  (value not drawn)
TP45  Test_Point_PCB  [Test_Point]  (value not drawn)
TP46  Test_Point_PCB  [Test_Point]  (value not drawn)
TP47  Test_Point_PCB  [Test_Point]  (value not drawn)
TP48  Test_Point_PCB  [Test_Point]  (value not drawn)
TP49  Test_Point_PCB  [Test_Point]  (value not drawn)
TP50  Test_Point_PCB  [Test_Point]  (value not drawn)
TP51  Test_Point_PCB  [Test_Point]  (value not drawn)
TP52  Test_Point_PCB  [Test_Point]  (value not drawn)
TP53  Test_Point_PCB  [Test_Point]  (value not drawn)
TP54  Test_Point_PCB  [Test_Point]  (value not drawn)
TP55  Test_Point_PCB  [Test_Point]  (value not drawn)
TP56  Test_Point_PCB  [Test_Point]  (value not drawn)
TP57  Test_Point_PCB  [Test_Point]  (value not drawn)
TP58  Test_Point_PCB  [Test_Point]  (value not drawn)
TP59  Test_Point_PCB  [Test_Point]  (value not drawn)
TP60  Test_Point_PCB  [Test_Point]  (value not drawn)
TP61  Test_Point_PCB  [Test_Point]  (value not drawn)
TP62  Test_Point_PCB  [Test_Point]  (value not drawn)
TP63  Test_Point_PCB  [Test_Point]  (value not drawn)
TP64  Test_Point_PCB  [Test_Point]  (value not drawn)
TP65  Test_Point_PCB  [Test_Point]  (value not drawn)
TP66  Test_Point_PCB  [Test_Point]  (value not drawn)
TP67  Test_Point_PCB  [Test_Point]  (value not drawn)
TP68  Test_Point_PCB  [Test_Point]  (value not drawn)
TP69  Test_Point_PCB  [Test_Point]  (value not drawn)
TP70  Test_Point_PCB  [Test_Point]  (value not drawn)
TP71  Test_Point_PCB  [Test_Point]  (value not drawn)
TP72  Test_Point_PCB  [Test_Point]  (value not drawn)
TP73  Test_Point_PCB  [Test_Point]  (value not drawn)
TP74  Test_Point_PCB  [Test_Point]  (value not drawn)
TP75  Test_Point_PCB  [Test_Point]  (value not drawn)
TP76  Test_Point_PCB  [Test_Point]  (value not drawn)
TP77  Test_Point_PCB  [Test_Point]  (value not drawn)
TP78  Test_Point_PCB  [Test_Point]  (value not drawn)
TP79  Test_Point_PCB  [Test_Point]  (value not drawn)
TP80  Test_Point_PCB  [Test_Point]  (value not drawn)
TP81  Test_Point_PCB  [Test_Point]  (value not drawn)
TP82  Test_Point_PCB  [Test_Point]  (value not drawn)
TP83  Test_Point_PCB  [Test_Point]  (value not drawn)
TP84  Test_Point_PCB  [Test_Point]  (value not drawn)
TP85  Test_Point_PCB  [Test_Point]  (value not drawn)
TP86  Test_Point_PCB  [Test_Point]  (value not drawn)
TP87  Test_Point_PCB  [Test_Point]  (value not drawn)
TP88  Test_Point_PCB  [Test_Point]  (value not drawn)
TP89  Test_Point_PCB  [Test_Point]  (value not drawn)
TP90  Test_Point_PCB  [Test_Point]  (value not drawn)
U1  LM1117MPX-3.3/NOPB  [DCY0004A_L]
U2  B0505S-1WR3  [FP-B0505S-1WR3-MFG]
U3  ADUM1401BRWZ  [ADI-RW-16_M]
U4  STM32F303CCT6  [LQFP48-7x7mm]  (parts A,B of 2)
U5  IR2104SPBF  [SOIC8_INF-M]
U6  IR2104SPBF  [SOIC8_INF-M]
U7  IR2104SPBF  [SOIC8_INF-M]
U8  IR2104SPBF  [SOIC8_INF-M]
U9  IR2104SPBF  [SOIC8_INF-M]
U10  IR2104SPBF  [SOIC8_INF-M]
U11  IR2104SPBF  [SOIC8_INF-M]
U12  IR2104SPBF  [SOIC8_INF-M]
U13  ACS758  [ACS758-100]  (value not drawn)
U14  MCP6001  [SOT-23-5]  (value not drawn)
U15  MCP6001  [SOT-23-5]  (value not drawn)
U16  MCP6001  [SOT-23-5]  (value not drawn)
U17  MCP6001  [SOT-23-5]  (value not drawn)
U18  MAX485ECSA+  [SOIC127P600X175-8N]  (value not drawn)
VD1  DIODE  [DO201AB]  (value not drawn)
VD2  DIODE  [DO201AB]  (value not drawn)
VD3  DIODE  [DO201AB]  (value not drawn)
VD4  DIODE  [DO201AB]  (value not drawn)
VD5  DIODE  [DO201AB]  (value not drawn)
VD6  DIODE  [DO201AB]  (value not drawn)
VD7  DIODE  [DO201AB]  (value not drawn)
VD8  DIODE  [DO201AB]  (value not drawn)
VD9  DIODE  [DO201AB]  (value not drawn)
VD10  DIODE  [DO201AB]  (value not drawn)
VD11  DIODE  [DO201AB]  (value not drawn)
VD12  DIODE  [DO201AB]  (value not drawn)
VD13  DIODE  [DO201AB]  (value not drawn)
VD14  DIODE  [DO201AB]  (value not drawn)
VD15  DIODE  [DO201AB]  (value not drawn)
VD16  DIODE  [DO201AB]  (value not drawn)
VD17  15V  [DO-017AA]
VD18  LED  [LED-0603]  (value not drawn)
VT1  IRF3205  [TO-220(bend2)]
VT2  IRF3205  [TO-220(bend2)]
VT3  IRF3205  [TO-220(bend2)]
VT4  IRF3205  [TO-220(bend2)]
VT5  IRF3205  [TO-220(bend2)]
VT6  IRF3205  [TO-220(bend2)]
VT7  IRF3205  [TO-220(bend2)]
VT8  IRF3205  [TO-220(bend2)]
VT9  IRF3205  [TO-220(bend2)]
VT10  IRF3205  [TO-220(bend2)]
VT11  IRF3205  [TO-220(bend2)]
VT12  IRF3205  [TO-220(bend2)]
VT13  IRF3205  [TO-220(bend2)]
VT14  IRF3205  [TO-220(bend2)]
VT15  IRF3205  [TO-220(bend2)]
VT16  IRF3205  [TO-220(bend2)]
ZD1  P6SMB16CA  [DO-214AA]  (value not drawn)
ZD2  P6SMB16CA  [DO-214AA]  (value not drawn)
ZD3  P6SMB16CA  [DO-214AA]  (value not drawn)
ZD4  P6SMB16CA  [DO-214AA]  (value not drawn)
ZD5  P6SMB16CA  [DO-214AA]  (value not drawn)
ZD6  P6SMB16CA  [DO-214AA]  (value not drawn)
ZD7  P6SMB16CA  [DO-214AA]  (value not drawn)
ZD8  P6SMB16CA  [DO-214AA]  (value not drawn)
ZD9  P6SMB16CA  [DO-214AA]  (value not drawn)
ZD10  P6SMB16CA  [DO-214AA]  (value not drawn)
ZD11  P6SMB16CA  [DO-214AA]  (value not drawn)
ZD12  P6SMB16CA  [DO-214AA]  (value not drawn)
ZD13  P6SMB16CA  [DO-214AA]  (value not drawn)
ZD14  P6SMB16CA  [DO-214AA]  (value not drawn)
ZD15  P6SMB16CA  [DO-214AA]  (value not drawn)
ZD16  P6SMB16CA  [DO-214AA]  (value not drawn)
ZD17  P6SMB16CA  [DO-214AA]  (value not drawn)
ZD18  P6SMB16CA  [DO-214AA]  (value not drawn)
ZD19  P6SMB16CA  [DO-214AA]  (value not drawn)

### Ports
+3.3V, +3.3V (bidir), ADC_1, ADC_2, ADC_3, ADC_4, CLEAR, Diff3, Diff4, DIRECT, DIRECT (bidir), INP_1, INP_2, INP_3, INP_4, INTERUPT, LED_1, LED_2, LED_3, PORT_1, PORT_2, PORT_3, PORT_4, PWM_1_1, PWM_1_2, PWM_2_1, PWM_2_2, PWM_3_1, PWM_3_2, PWM_4_1, PWM_4_2, RESET (bidir), RX, RX (bidir), RX_1, RX_1 (bidir), SCL (bidir), SDA (bidir), SENS_1, SENS_2, SENS_3, SENS_4, START, STOP, SWCLC (bidir), SWDIO (bidir), TIME_in_1, TX, TX (bidir), TX_1, TX_1 (bidir)

### Nets
+3V3: C58.1(+) C59.1 D33.1(C) J6.1 J7.1 J11.1 L4.2 L5.2 P1.1 P12.4 P14.4 R4.2 R5.2 R58.1 R61.1 R116.2 R117.2 R118.2 TP2.1(G9) TP73.1(G9) TP86.1(G9) ; port +3.3V
+3V3_All: C61.1(+) C62.1(+) C63.1(+) C64.1(+) C65.1 C66.1 C67.1 C68.1 C89.1 C90.1(+) L9.2 TP90.1(G9) U14.5(VDD) U15.5(VDD) U16.5(VDD) U17.5(VDD)
+5V: C26.1 C27.1 C40.1 C45.1(+) D23.8(V+) J4.1 J6.2 J11.2 L1.2 L6.1 P2.3 P4.3 P8.3 P9.3 P10.3 P11.3 P12.5 P13.5 P14.5 R87.2 R88.2 R99.2 R100.2 RP6.1(CCW) RP7.1(CCW) RP8.1(CCW) RP9.1(CCW) TP13.1(G9) TP14.1(G9) U1.3(IN) U13.1(+VCC)
+5V_ISO: C28.1 R3.2 R8.2 R9.2 TP1.1(G9) U2.4(+Vo) U3.10(VE2) U3.16(VDD2) U18.8(VCC)
+5V_RS: C1.1(+) C85.1 L6.2 U2.2(VIN) U3.1(VDD1) U3.7(VE1)
GND: BT1.1(-) C1.2(-) C2.2(-) C3.1(C) C4.2(-) C5.2(-) C6.2(-) C8.2 C9.1 C10.2 C11.1 C15.1 C16.1 C17.1 C18.1 C19.1 C20.2 C21.2 C22.2 C23.2 C25.1 C26.2 C27.2 C30.1 C34.1 C36.1 C38.2(-) C39.2(-) C40.2 C42.2 C43.1 C44.1 C45.2(-) C46.2 C49.2 C51.2 C53.2 C57.2(-) C58.2(-) C59.2 C61.2(-) C62.2(-) C63.2(-) C64.2(-) C65.2 C66.2 C67.2 C68.2 C85.2 C86.1 C87.1 C88.2(-) C89.2 C90.2(-) C91.2(-) C92.2 C93.2 C94.2 C95.2 C96.2 D22.2(K) D23.4(V-) D28.2(K) D29.2(K) D30.2(K) D31.2(K) D32.2(A) D33.2(A) J1.1 J2.2 J3.1 J4.2 J6.6 J7.6 J11.6 J13.1 LED3.1(K) LED4.1(K) P1.4 P2.1 P4.1 P8.1 P9.1 P10.1 P11.1 P12.1 P13.1 P14.1 R2.2 R12.1 R13.1 R17.1 R18.1 R22.2 R23.1 R24.1 R29.1 R32.1 R35.1 R36.1 R37.1 R39.2 R40.1 R46.1 R47.1 R49.1 R50.1 R55.1 R56.1 R62.2 R63.1 R64.1 R79.1 R80.1 R81.1 R82.1 R93.1 R94.1 R95.1 R96.1 R101.2 R102.2 R111.1 R112.1 R120.2 R126.1 R128.1 R130.1 R132.1 R134.1 R137.1 R138.1 R141.1 R142.1 R143.2 R144.2 RG1.2(GND) RP6.3(CW) RP7.3(CW) RP8.3(CW) RP9.3(CW) SW1.1 SW1.2 SW2.1 SW2.2 SW3.1 SW3.2 U1.1(GND) U2.1(GND) U3.2(GND1) U3.8(GND1) U4.8(VSSA/VREF-) U4.23(VSS) U4.35(VSS) U4.47(VSS) U5.4(COM) U6.4(COM) U7.4(COM) U8.4(COM) U9.4(COM) U10.4(COM) U11.4(COM) U12.4(COM) U13.2(GND) U14.2(VSS) U15.2(VSS) U16.2(VSS) U17.2(VSS) VD17.2(A) VD18.1(C) ZD4.1(A)
GND_2: C28.2 J5.2 R124.1 R125.1 TP55.1(G9) U2.3(0V) U3.9(GND2) U3.15(GND2) U18.5(GND) ZD18.1(A) ZD19.1(A)
V_BAT: C7.2 C14.1 C32.1 C39.1(+) C42.1 C48.2 C56.2 C69.1 C70.2 C71.1 C73.2 C74.2 C75.1 C76.1 C79.2 C80.1 C81.2 C82.1 L3.2 TP6.1(G9) VD1.2(A) VD2.2(A) VD5.2(A) VD6.2(A) VD9.2(A) VD10.2(A) VD13.2(A) VD14.2(A) VT1.D VT2.D VT5.D VT7.D VT8.D VT9.D VT13.D VT14.D
V_PS: C38.1(+) J12.2 L3.1 R1.2 R53.2 U13.5(-IP)
VCC: C3.2(A) C5.1(+) D32.1(C) J1.2 J13.2 L7.1 L8.1 RG1.1(Input) TP88.1(G9) ZD4.2(A)
VCC_DRV_1: C4.1(+) C9.2 C15.2 C25.2 C34.2 C86.2 D1.2(A) D10.2(A) D11.2(A) D19.2(A) L8.2 TP79.1(G9) TP81.1(G9) TP83.1(G9) TP85.1(G9) TP89.1(G9) U5.1(VCC) U8.1(VCC) U9.1(VCC) U11.1(VCC)
VCC_DRV_2: C11.2 C16.2 C30.2 C36.2 C87.2 C88.1(+) D2.2(A) D6.2(A) D12.2(A) D20.2(A) L7.2 TP78.1(G9) TP80.1(G9) TP82.1(G9) TP84.1(G9) TP87.1(G9) U6.1(VCC) U7.1(VCC) U10.1(VCC) U12.1(VCC)
NetBT1_2: BT1.2(+) D27.1(C) U4.1(VBAT)
NetC2_1: C2.1(+) L1.1 RG1.3(Output) TP56.1(G9)
NetC6_1: C6.1(+) C8.1 C10.1 C57.1(+) D27.2(A) L4.1 R10.2 TP71.1(G9) U4.9(VDDA/VREF+) U4.24(VDD) U4.36(VDD) U4.48(VDD)
NetC7_1: C7.1 C13.1 C33.2 J9.1 R131.1 U6.6(VS) VD2.1(C) VD3.2(A) VT2.S VT3.D ZD3.1(A)
NetC12_1: C12.1 C48.1 C55.2 J8.1 R127.1 U5.6(VS) VD1.1(C) VD4.2(A) VT1.S VT4.D ZD1.1(A)
NetC12_2: C12.2 D1.1(C) TP23.1(G9) U5.8(VB)
NetC13_2: C13.2 D2.1(C) TP24.1(G9) U6.8(VB)
NetC14_2: C14.2 C55.1 C60.1 C69.2 R29.2 R30.2 TP43.1(G9) VD4.1(C) VD7.1(C) VT4.S VT10.S ZD2.1(A) ZD9.1(A)
NetC17_2: C17.2 J11.5 R116.1 SW1.3 SW1.4 U4.41(PB5) ; port CLEAR
NetC18_2: C18.2 J11.3 R117.1 SW2.3 SW2.4 U4.2(PC13) ; port START
NetC19_2: C19.2 J11.4 R118.1 SW3.3 SW3.4 U4.3(PC14-OSC32_IN) ; port STOP
NetC20_1: C20.1 R30.1 R35.2 R69.2 TP45.1(G9) ; port ADC_3
NetC21_1: C21.1 R33.1 R36.2 R71.2 TP46.1(G9) ; port ADC_4
NetC22_1: C22.1 R74.2 R110.1 R112.2 TP70.1(G9) ; port ADC_1
NetC23_1: C23.1 R73.2 R108.1 R111.2 TP69.1(G9) ; port ADC_2
NetC24_1: C24.1 C56.1 C60.2 J8.2 R129.1 TP39.1(G9) U8.6(VS) VD5.1(C) VD7.2(A) VT7.S VT10.D ZD7.1(A)
NetC24_2: C24.2 D10.1(C) TP33.1(G9) U8.8(VB)
NetC29_1: C29.1 C73.1 C77.2 J10.1 R135.1 U9.6(VS) VD9.1(C) VD11.2(A) VT8.S VT11.D ZD10.1(A)
NetC29_2: C29.2 D11.1(C) TP47.1(G9) U9.8(VB)
NetC31_1: C31.1 C74.1 C78.2 J15.1 R136.1 U10.6(VS) VD10.1(C) VD12.2(A) VT9.S VT12.D ZD11.1(A)
NetC31_2: C31.2 D12.1(C) TP48.1(G9) U10.8(VB)
NetC32_2: C32.2 C33.1 C71.2 C72.1 R32.2 R33.2 TP44.1(G9) VD3.1(C) VD8.1(C) VT3.S VT6.S ZD5.1(A) ZD8.1(A)
NetC35_1: C35.1 C81.1 C84.2 J10.2 R140.1 TP63.1(G9) U11.6(VS) VD14.1(C) VD16.2(A) VT13.S VT15.D ZD15.1(A)
NetC35_2: C35.2 D19.1(C) TP57.1(G9) U11.8(VB)
NetC37_1: C37.1 C79.1 C83.2 J15.2 R139.1 TP64.1(G9) U12.6(VS) VD13.1(C) VD15.2(A) VT14.S VT16.D ZD14.1(A)
NetC37_2: C37.2 D20.1(C) TP58.1(G9) U12.8(VB)
NetC41_1: C41.1 C70.1 C72.2 J9.2 R133.1 TP40.1(G9) U7.6(VS) VD6.1(C) VD8.2(A) VT5.S VT6.D ZD6.1(A)
NetC41_2: C41.2 D6.1(C) TP34.1(G9) U7.8(VB)
NetC43_2: C43.2 R53.1 R55.2 TP4.1(G9) U4.13(PA3) ; port INP_1
NetC44_2: C44.2 R54.1 R56.2 TP5.1(G9) U4.20(PB2) ; port INP_2
NetC46_1: C46.1 R69.1 U16.3(VIN+)
NetC47_1: C47.1 R70.2 R144.1 U16.4(VIN-)
NetC47_2: C47.2 R70.1 R147.2 TP77.1(G9) U16.1(VOUT)
NetC49_1: C49.1 R71.1 U17.3(VIN+)
NetC50_1: C50.1 R72.2 R143.1 U17.4(VIN-)
NetC50_2: C50.2 R72.1 R148.2 TP76.1(G9) U17.1(VOUT)
NetC51_1: C51.1 R73.1 U14.3(VIN+)
NetC52_1: C52.1 R62.1 R76.2 U14.4(VIN-)
NetC52_2: C52.2 R76.1 R146.2 TP75.1(G9) U14.1(VOUT)
NetC53_1: C53.1 R74.1 U15.3(VIN+)
NetC54_1: C54.1 R77.2 R120.1 U15.4(VIN-)
NetC54_2: C54.2 R77.1 R145.2 TP74.1(G9) U15.1(VOUT)
NetC75_2: C75.2 C77.1 C82.2 C84.1 R64.2 R108.2 TP67.1(G9) VD11.1(C) VD16.1(C) VT11.S VT15.S ZD13.1(A) ZD17.1(A)
NetC76_2: C76.2 C78.1 C80.2 C83.1 R63.2 R110.2 TP68.1(G9) VD12.1(C) VD15.1(C) VT12.S VT16.S ZD12.1(A) ZD16.1(A)
NetC91_1: C91.1(+) C92.1 L5.1 L9.1 R57.2 TP72.1(G9) U1.2(OUT) U1.4(TAB)
NetC93_1: C93.1 R146.1 U4.15(PA5) ; port SENS_2
NetC94_1: C94.1 R147.1 U4.16(PA6) ; port SENS_3
NetC95_1: C95.1 R145.1 U4.14(PA4) ; port SENS_1
NetC96_1: C96.1 R148.1 U4.17(PA7) ; port SENS_4
NetD3_1: D3.1(C) R6.1 R7.2 TP26.1(G9)
NetD3_2: D3.2(A) R6.2 R131.2 VT2.G ZD3.2(A)
NetD4_1: D4.1(C) R11.1 R14.2 TP25.1(G9)
NetD4_2: D4.2(A) R11.2 R127.2 VT1.G ZD1.2(A)
NetD5_1: D5.1(C) R15.1 R16.2 TP30.1(G9)
NetD5_2: D5.2(A) R16.1 R132.2 VT3.G ZD5.2(A)
NetD7_1: D7.1(C) R25.1 R28.2 TP29.1(G9)
NetD7_2: D7.2(A) R28.1 R128.2 VT4.G ZD2.2(A)
NetD8_1: D8.1(C) R19.1 R21.2 TP36.1(G9)
NetD8_2: D8.2(A) R19.2 R133.2 VT5.G ZD6.2(A)
NetD9_1: D9.1(C) R26.1 R27.2 TP42.1(G9)
NetD9_2: D9.2(A) R27.1 R134.2 VT6.G ZD8.2(A)
NetD13_1: D13.1(C) R31.1 R34.2 TP35.1(G9)
NetD13_2: D13.2(A) R31.2 R129.2 VT7.G ZD7.2(A)
NetD14_1: D14.1(C) R41.1 R43.2 TP49.1(G9)
NetD14_2: D14.2(A) R41.2 R135.2 VT8.G ZD10.2(A)
NetD15_1: D15.1(C) R42.1 R44.2 TP50.1(G9)
NetD15_2: D15.2(A) R42.2 R136.2 VT9.G ZD11.2(A)
NetD16_1: D16.1(C) R45.1 R48.2 TP8.1(G9)
NetD16_2: D16.2(A) R48.1 R130.2 VT10.G ZD9.2(A)
NetD17_1: D17.1(C) R51.1 R59.2 TP53.1(G9)
NetD17_2: D17.2(A) R59.1 R138.2 VT11.G ZD13.2(A)
NetD18_1: D18.1(C) R52.1 R60.2 TP54.1(G9)
NetD18_2: D18.2(A) R60.1 R137.2 VT12.G ZD12.2(A)
NetD21_1: D21.1(C) R65.1 R75.2 TP59.1(G9)
NetD21_2: D21.2(A) R65.2 R140.2 VT13.G ZD15.2(A)
NetD22_1: D22.1(A) R57.1
NetD23_1: D23.1(OUT) R84.2 R90.2 R92.2 TP16.1(G9)
NetD23_2: D23.2(IN-) R84.1 R98.2 R100.1 R102.1 RP9.2(WIPER) TP22.1(G9) ; port Diff3
NetD23_3: D23.3(IN+) R86.2 R88.1 R94.2 RP7.2(WIPER) TP20.1(G9)
NetD23_5: D23.5(IN+) R85.2 R87.1 R93.2 RP6.2(WIPER) TP19.1(G9)
NetD23_6: D23.6(IN-) R83.1 R97.2 R99.1 R101.1 RP8.2(WIPER) TP21.1(G9) ; port Diff4
NetD23_7: D23.7(OUT) R83.2 R89.2 R91.2 TP15.1(G9)
NetD24_1: D24.1(C) R68.1 R78.2 TP60.1(G9)
NetD24_2: D24.2(A) R68.2 R139.2 VT14.G ZD14.2(A)
NetD25_1: D25.1(C) R103.1 R105.2 TP65.1(G9)
NetD25_2: D25.2(A) R105.1 R142.2 VT15.G ZD17.2(A)
NetD26_1: D26.1(C) R104.1 R106.2 TP66.1(G9)
NetD26_2: D26.2(A) R106.1 R141.2 VT16.G ZD16.2(A)
NetD28_1: D28.1(A) R123.1
NetD29_1: D29.1(A) R113.1
NetD30_1: D30.1(A) R114.1
NetD31_1: D31.1(A) R115.1
NetJ2_1: J2.1 L2.2
NetJ3_2: J3.2 U13.4(+IP)
NetJ5_1: J5.1 R124.2 U18.7(B) ZD19.2(A)
NetJ5_3: J5.3 R3.1 TP11.1(G9) U18.6(A) ZD18.2(A)
NetJ6_3: J6.3 R4.1 TP32.1(G9) U3.6(VOD) U4.40(PB4) ; port RX
NetJ6_4: J6.4 R5.1 TP10.1(G9) U3.4(VIB) U4.12(PA2) ; port TX
NetJ6_5: J6.5 R123.2 R126.2 TP9.1(G9) U3.5(VIC) U4.31(PA10) ; port DIRECT
NetJ7_2: J7.2 P1.2 U4.34(PA13) ; port SWDIO
NetJ7_3: J7.3 P1.3 U4.37(PA14) ; port SWCLC
NetJ7_4: J7.4 U4.42(PB6) ; port TX_1
NetJ7_5: J7.5 U4.43(PB7) ; port RX_1
NetJ12_1: J12.1 L2.1
NetLED3_2: LED3.2(A) R89.1
NetLED4_2: LED4.2(A) R90.1
NetP2_2: P2.2 R20.2
NetP4_2: P4.2 R38.2
NetP8_2: P8.2 R85.1
NetP9_2: P9.2 R86.1
NetP10_2: P10.2 R97.1
NetP11_2: P11.2 R98.1
NetP12_2: P12.2 P14.2 R61.2 U4.45(PB8) ; port SCL
NetP12_3: P12.3 P14.3 R58.2 U4.46(PB9) ; port SDA
NetP13_2: P13.2 R115.2 U4.6(PF1-OSC_OUT) ; port LED_3
NetP13_3: P13.3 R114.2 U4.5(PF0-OSC_IN) ; port LED_2
NetP13_4: P13.4 R113.2 U4.4(PC15-OSC_OUT) ; port LED_1
NetR1_1: R1.1 R121.2 VD17.1(C)
NetR2_1: R2.1 U4.44(BOOT0)
NetR7_1: R7.1 U6.7(HO)
NetR8_1: R8.1 R122.1 TP31.1(G9) U18.1(RO)
NetR9_1: R9.1 R119.1 TP7.1(G9) U18.4(DI)
NetR10_1: R10.1 U4.7(NRST) ; port RESET
NetR12_2: R12.2 TP27.1(G9) U4.27(PB14) U5.2(IN) ; port PWM_3_1
NetR13_2: R13.2 R24.2 U4.26(PB13) U6.3(*SD) U7.3(*SD) ; port PORT_4
NetR14_1: R14.1 U5.7(HO)
NetR15_2: R15.2 U6.5(LO)
NetR17_2: R17.2 TP28.1(G9) U4.38(PA15) U6.2(IN) ; port PWM_4_1
NetR18_2: R18.2 R40.2 U4.25(PB12) U5.3(*SD) U8.3(*SD) ; port PORT_3
NetR20_1: R20.1 R22.1 U4.11(PA1) ; port INTERUPT
NetR21_1: R21.1 U7.7(HO)
NetR23_2: R23.2 TP37.1(G9) U4.28(PB15) U8.2(IN) ; port PWM_3_2
NetR25_2: R25.2 U5.5(LO)
NetR26_2: R26.2 U7.5(LO)
NetR34_1: R34.1 U8.7(HO)
NetR37_2: R37.2 TP38.1(G9) U4.39(PB3) U7.2(IN) ; port PWM_4_2
NetR38_1: R38.1 R39.1 U4.10(PA0) ; port TIME_in_1
NetR43_1: R43.1 U9.7(HO)
NetR44_1: R44.1 U10.7(HO)
NetR45_2: R45.2 U8.5(LO)
NetR46_2: R46.2 TP51.1(G9) U4.30(PA9) U9.2(IN) ; port PWM_2_1
NetR47_2: R47.2 R80.2 U4.21(PB10) U9.3(*SD) U11.3(*SD) ; port PORT_2
NetR49_2: R49.2 TP52.1(G9) U4.29(PA8) U10.2(IN) ; port PWM_1_1
NetR50_2: R50.2 R82.2 U4.22(PB11) U10.3(*SD) U12.3(*SD) ; port PORT_1
NetR51_2: R51.2 U9.5(LO)
NetR52_2: R52.2 U10.5(LO)
NetR54_2: R54.2 TP3.1(G9) U13.3(OUT)
NetR75_1: R75.1 U11.7(HO)
NetR78_1: R78.1 U12.7(HO)
NetR79_2: R79.2 TP61.1(G9) U4.33(PA12) U11.2(IN) ; port PWM_2_2
NetR81_2: R81.2 TP62.1(G9) U4.32(PA11) U12.2(IN) ; port PWM_1_2
NetR91_1: R91.1 R95.2 TP17.1(G9) U4.19(PB1) ; port INP_4
NetR92_1: R92.1 R96.2 TP18.1(G9) U4.18(PB0) ; port INP_3
NetR103_2: R103.2 U11.5(LO)
NetR104_2: R104.2 U12.5(LO)
NetR119_2: R119.2 U3.13(VOB)
NetR121_1: R121.1 VD18.2(A)
NetR122_2: R122.2 U3.11(VID)
NetR125_2: R125.2 TP12.1(G9) U3.12(VOC) U18.2(~{RE}) U18.3(DE)

Not connected (* = marked no-connect by the designer): U3 3(VIA) 14(VOA)

### Layout directives
net class HV: NetC7_1, NetC12_1, NetC14_2, NetC24_1, NetC29_1, NetC31_1, NetC32_2, NetC35_1, NetC37_1, NetC41_1, NetC75_2, NetC76_2, NetJ2_1, NetJ3_2, NetJ12_1, NetR1_1, V_BAT, V_PS